# Altium project WUT-4-3-3.PrjPCB (part 1 of 2)
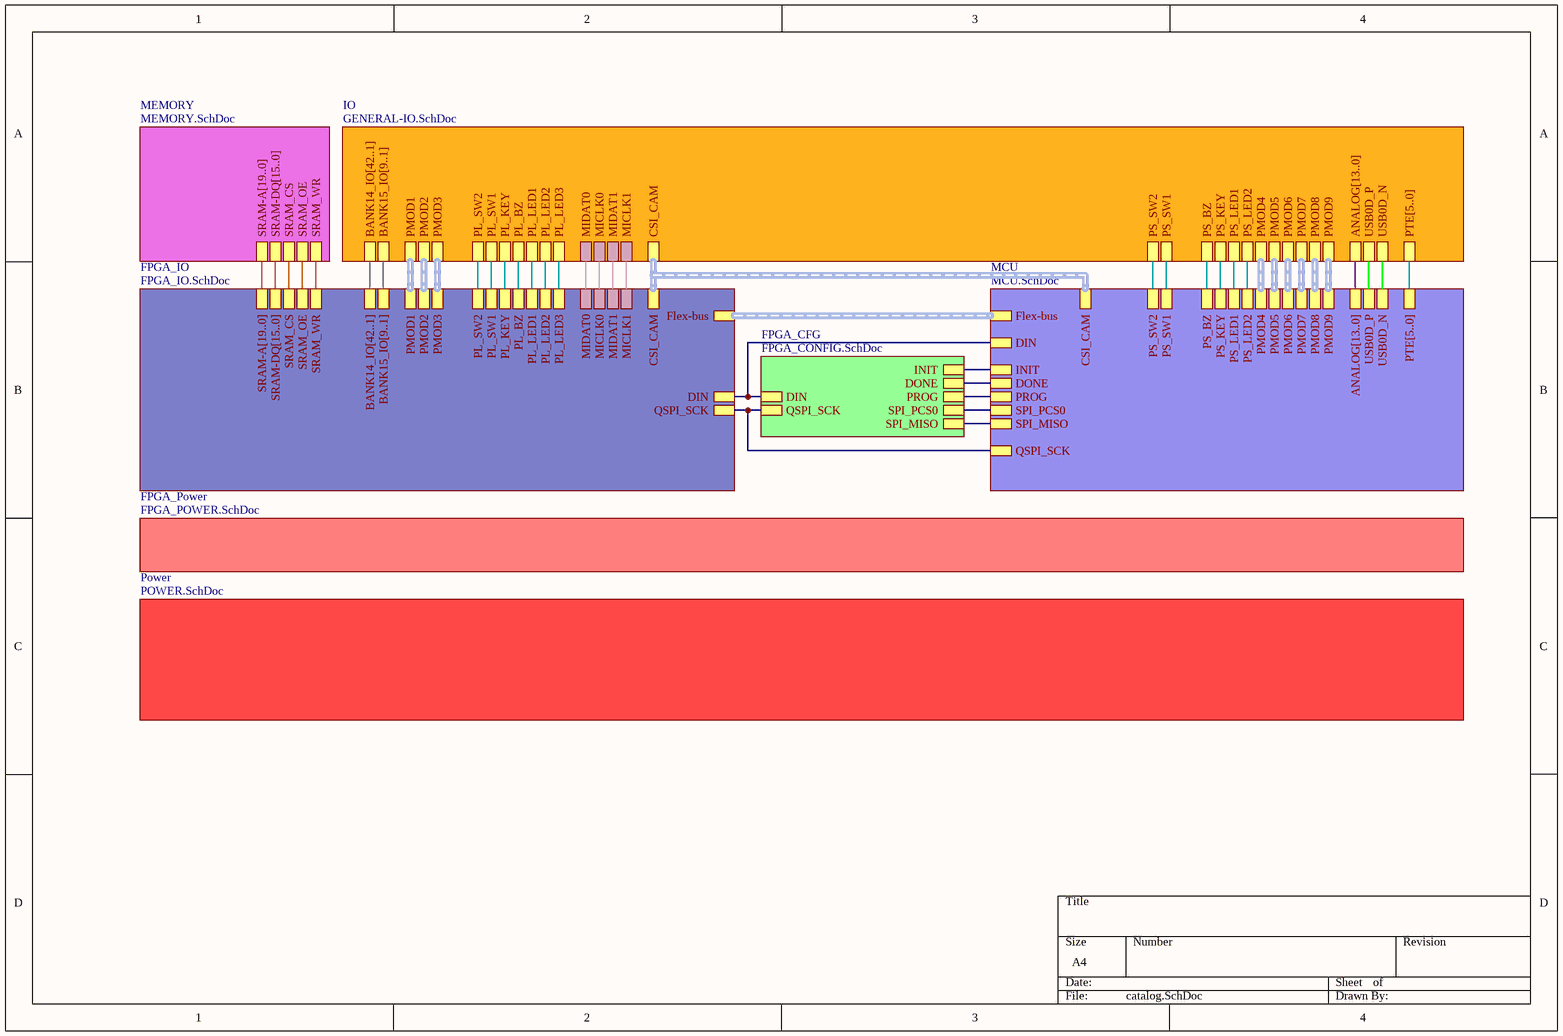
[diagram p0: catalog.SchDoc]
8 sheets, 241 parts. Net scope: hierarchical (ports join the sheet entries above them; power ports are global).
Board file: WUT-4-3-5.PcbDoc
Sheets:
  catalog.SchDoc
    FPGA_IO = FPGA_IO.SchDoc
    Power = POWER.SchDoc
    IO = GENERAL-IO.SchDoc
    MEMORY = MEMORY.SchDoc
    FPGA_CFG = FPGA_CONFIG.SchDoc
    FPGA_Power = FPGA_POWER.SchDoc
    MCU = MCU.SchDoc

## Sheet catalog.SchDoc
size A4

### Sub-sheets
FPGA_CFG = FPGA_CONFIG.SchDoc: QSPI_SCK, DIN, INIT, DONE, PROG, SPI_PCS0, SPI_MISO
FPGA_IO = FPGA_IO.SchDoc: QSPI_SCK, BANK14_IO[42..1], BANK15_IO[9..1], DIN, Flex-bus (harness Flexbus), SRAM-A[19..0] (harness Flexbus), SRAM-DQ[15..0] (harness Flexbus), SRAM_CS, SRAM_OE, SRAM_WR, PL_SW2, PL_SW1, PL_KEY, PL_LED1, PL_LED2, PL_LED3, PMOD1 (harness PMOD), PMOD2 (harness PMOD), PMOD3 (harness PMOD), PL_BZ, CSI_CAM (harness CSI_CAM), MIDAT0, MIDAT1, MICLK0, MICLK1
FPGA_Power = FPGA_POWER.SchDoc: no entries
IO = GENERAL-IO.SchDoc: BANK14_IO[42..1], BANK15_IO[9..1], PTE[5..0] (harness Flexbus), USB0D_P, USB0D_N, ANALOG[13..0], PMOD4 (harness PMOD), PS_LED2, PS_LED1, PL_SW2, PL_SW1, PL_KEY, PS_KEY, PS_SW1, PS_SW2, PL_LED1, PL_LED2, PL_LED3, PMOD1 (harness PMOD), PMOD2 (harness PMOD), PMOD3 (harness PMOD), PL_BZ, PS_BZ, PMOD7 (harness PMOD), PMOD6 (harness PMOD), PMOD5 (harness PMOD), PMOD8 (harness PMOD), PMOD9 (harness PMOD), CSI_CAM (harness CSI_CAM), MIDAT0, MIDAT1, MICLK0, MICLK1
MCU = MCU.SchDoc: Flex-bus (harness Flexbus), PTE[5..0] (harness Flexbus), USB0D_N, USB0D_P, ANALOG[13..0], PMOD7 (harness PMOD), PMOD4 (harness PMOD), PMOD6 (harness PMOD), PMOD5 (harness PMOD), DIN, INIT, DONE, PROG, SPI_PCS0, SPI_MISO, QSPI_SCK, PS_LED2, PS_LED1, PS_KEY, PS_SW1, PS_SW2, PS_BZ, PMOD8 (harness PMOD), PMOD9 (harness PMOD), CSI_CAM (harness CSI_CAM)
MEMORY = MEMORY.SchDoc: SRAM-A[19..0] (harness Flexbus), SRAM-DQ[15..0] (harness Flexbus), SRAM_CS, SRAM_OE, SRAM_WR
Power = POWER.SchDoc: no entries

### Nets
BANK14_IO1: sheet FPGA_IO/PL_KEY, sheet IO/PL_KEY
BANK14_IO2: sheet FPGA_IO/PL_LED3, sheet IO/PL_LED3
BANK14_IO4: sheet FPGA_IO/PL_LED1, sheet IO/PL_LED1
BANK14_IO5: sheet FPGA_IO/PL_LED2, sheet IO/PL_LED2
BANK14_IO6: sheet FPGA_IO/PL_BZ, sheet IO/PL_BZ
BANK34_IO1: sheet FPGA_IO/MICLK0, sheet IO/MICLK0
BANK34_IO2: sheet FPGA_IO/MIDAT0, sheet IO/MIDAT0
BANK34_IO13: sheet FPGA_IO/PL_SW1, sheet IO/PL_SW1
BANK34_IO20: sheet FPGA_IO/PL_SW2, sheet IO/PL_SW2
BANK35_IO9: sheet FPGA_IO/MIDAT1, sheet IO/MIDAT1
BANK35_IO10: sheet FPGA_IO/MICLK1, sheet IO/MICLK1
DIN: sheet FPGA_IO/DIN, sheet FPGA_CFG/DIN, sheet MCU/DIN
DONE: sheet FPGA_CFG/DONE, sheet MCU/DONE
FPGA_INIT: sheet FPGA_CFG/INIT, sheet MCU/INIT
PROG: sheet FPGA_CFG/PROG, sheet MCU/PROG
PTA6: sheet IO/PS_SW1, sheet MCU/PS_SW1
PTA7: sheet IO/PS_SW2, sheet MCU/PS_SW2
PTD8: sheet IO/PS_LED1, sheet MCU/PS_LED1
PTD9: sheet IO/PS_LED2, sheet MCU/PS_LED2
PTE26: sheet IO/PS_BZ, sheet MCU/PS_BZ
PTE27: sheet IO/PS_KEY, sheet MCU/PS_KEY
QSPI_SCK: sheet FPGA_IO/QSPI_SCK, sheet FPGA_CFG/QSPI_SCK, sheet MCU/QSPI_SCK
SPI2_PCS0: sheet FPGA_CFG/SPI_PCS0, sheet MCU/SPI_PCS0
SPI2_SIN: sheet FPGA_CFG/SPI_MISO, sheet MCU/SPI_MISO
SRAM_CS: sheet FPGA_IO/SRAM_CS, sheet MEMORY/SRAM_CS
SRAM_OE: sheet FPGA_IO/SRAM_OE, sheet MEMORY/SRAM_OE
SRAM_WR: sheet FPGA_IO/SRAM_WR, sheet MEMORY/SRAM_WR
USB0D_N: sheet IO/USB0D_N, sheet MCU/USB0D_N
USB0D_P: sheet IO/USB0D_P, sheet MCU/USB0D_P

### Buses and harness runs
bus sheet FPGA_IO/BANK14_IO[42..1] = sheet IO/BANK14_IO[42..1]
bus sheet FPGA_IO/BANK15_IO[9..1] = sheet IO/BANK15_IO[9..1]
bus sheet IO/ANALOG[13..0] = sheet MCU/ANALOG[13..0]
harness sheet FPGA_IO/CSI_CAM = sheet IO/CSI_CAM = sheet MCU/CSI_CAM
harness sheet FPGA_IO/Flex-bus = sheet MCU/Flex-bus
harness sheet FPGA_IO/PMOD1 = sheet IO/PMOD1
harness sheet FPGA_IO/PMOD2 = sheet IO/PMOD2
harness sheet FPGA_IO/PMOD3 = sheet IO/PMOD3
harness sheet IO/PMOD4 = sheet MCU/PMOD4
harness sheet IO/PMOD5 = sheet MCU/PMOD5
harness sheet IO/PMOD6 = sheet MCU/PMOD6
harness sheet IO/PMOD7 = sheet MCU/PMOD7
harness sheet IO/PMOD8 = sheet MCU/PMOD8
harness sheet IO/PMOD9 = sheet MCU/PMOD9

## Sheet FPGA_IO.SchDoc
size A3
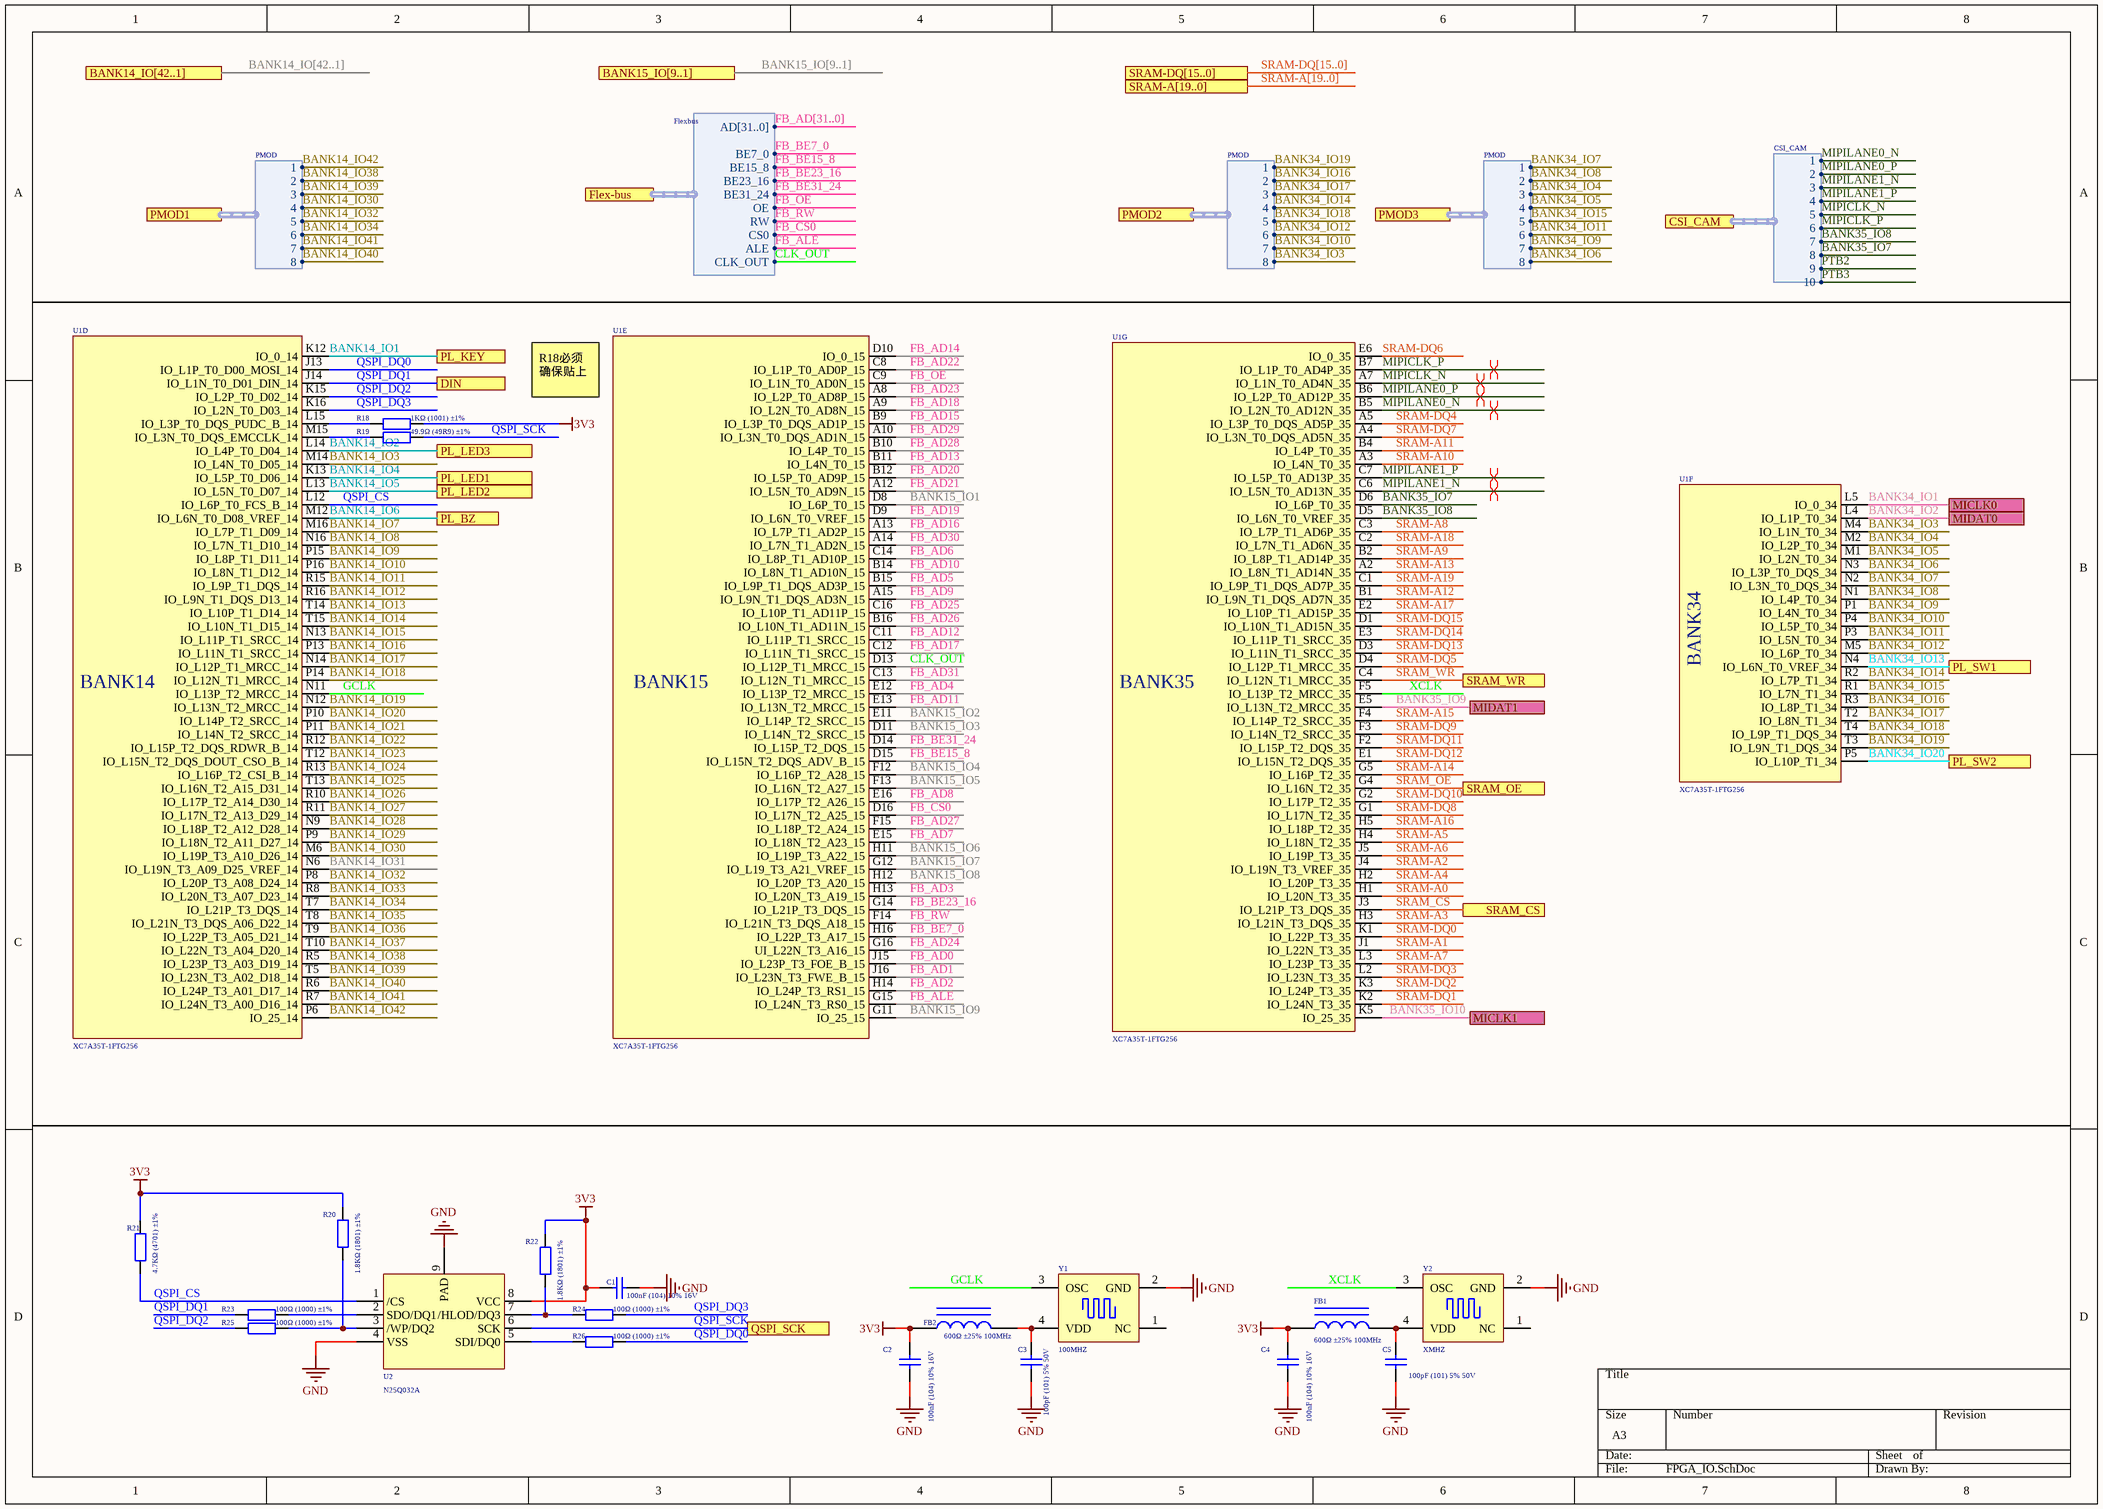
[diagram p1: FPGA_IO.SchDoc]

### Parts
C1  100nF (104) 10% 16V  [0402_C]
C2  100nF (104) 10% 16V  [0402_C]
C3  100pF (101) 5% 50V  [0402_C]
C4  100nF (104) 10% 16V  [0402_C]
C5  100pF (101) 5% 50V  [0402_C]
FB1  600Ω ±25% 100MHz  [0805_L]
FB2  600Ω ±25% 100MHz  [0805_L]
R18  1KΩ (1001) ±1%  [0402_R]
R19  49.9Ω (49R9) ±1%  [0402_R]
R20  1.8KΩ (1801) ±1%  [0603_R]
R21  4.7KΩ (4701) ±1%  [0402_R]
R22  1.8KΩ (1801) ±1%  [0603_R]
R23  100Ω (1000) ±1%  [0402_R]
R24  100Ω (1000) ±1%  [0402_R]
R25  100Ω (1000) ±1%  [0402_R]
R26  100Ω (1000) ±1%  [0402_R]
U1  XC7A35T-1FTG256  [BGA100P9X9-81A]  (parts D,E,F,G of 7)
U2  N25Q032A  [QFN127P500X600X100_HS-9N]
Y1  100MHZ  [XTAL7_3225]
Y2  XMHZ  [XTAL7_3225]

### Ports
BANK14_IO[42..1], BANK15_IO[9..1], CSI_CAM (harness CSI_CAM), DIN, Flex-bus (harness Flexbus), MICLK0, MICLK1, MIDAT0, MIDAT1, PL_BZ, PL_KEY, PL_LED1, PL_LED2, PL_LED3, PL_SW1, PL_SW2, PMOD1 (harness PMOD), PMOD2 (harness PMOD), PMOD3 (harness PMOD), QSPI_SCK, SRAM-A[19..0], SRAM-DQ[15..0], SRAM_CS, SRAM_OE, SRAM_WR

### Harnesses
Flexbus: BE7_0, CS0, BE31_24, CLK_OUT, ALE, BE23_16, RW, BE15_8, OE, AD[31..0]
PMOD: 1, 2, 3, 4, 5, 6, 7, 8
CSI_CAM: 1, 2, 3, 4, 5, 6, 7, 8, 9, 10

### Nets
3V3: C1.1 C2.2 C4.2 FB1.1 FB2.1 R18.2 R20.2 R21.2 R22.2 U2.8(VCC)
GND: C1.2 C2.1 C3.1 C4.1 C5.1 U2.4(VSS) U2.9(PAD) Y1.2(GND) Y2.2(GND)
BANK14_IO1: U1.K12(IO_0_14) ; port PL_KEY
BANK14_IO2: U1.L14(IO_L4P_T0_D04_14) ; port PL_LED3
BANK14_IO3: U1.M14(IO_L4N_T0_D05_14)
BANK14_IO4: U1.K13(IO_L5P_T0_D06_14) ; port PL_LED1
BANK14_IO5: U1.L13(IO_L5N_T0_D07_14) ; port PL_LED2
BANK14_IO6: U1.M12(IO_L6N_T0_D08_VREF_14) ; port PL_BZ
BANK14_IO7: U1.M16(IO_L7P_T1_D09_14)
BANK14_IO8: U1.N16(IO_L7N_T1_D10_14)
BANK14_IO9: U1.P15(IO_L8P_T1_D11_14)
BANK14_IO10: U1.P16(IO_L8N_T1_D12_14)
BANK14_IO11: U1.R15(IO_L9P_T1_DQS_14)
BANK14_IO12: U1.R16(IO_L9N_T1_DQS_D13_14)
BANK14_IO13: U1.T14(IO_L10P_T1_D14_14)
BANK14_IO14: U1.T15(IO_L10N_T1_D15_14)
BANK14_IO15: U1.N13(IO_L11P_T1_SRCC_14)
BANK14_IO16: U1.P13(IO_L11N_T1_SRCC_14)
BANK14_IO17: U1.N14(IO_L12P_T1_MRCC_14)
BANK14_IO18: U1.P14(IO_L12N_T1_MRCC_14)
BANK14_IO19: U1.N12(IO_L13N_T2_MRCC_14)
BANK14_IO20: U1.P10(IO_L14P_T2_SRCC_14)
BANK14_IO21: U1.P11(IO_L14N_T2_SRCC_14)
BANK14_IO22: U1.R12(IO_L15P_T2_DQS_RDWR_B_14)
BANK14_IO23: U1.T12(IO_L15N_T2_DQS_DOUT_CSO_B_14)
BANK14_IO24: U1.R13(IO_L16P_T2_CSI_B_14)
BANK14_IO25: U1.T13(IO_L16N_T2_A15_D31_14)
BANK14_IO26: U1.R10(IO_L17P_T2_A14_D30_14)
BANK14_IO27: U1.R11(IO_L17N_T2_A13_D29_14)
BANK14_IO28: U1.N9(IO_L18P_T2_A12_D28_14)
BANK14_IO29: U1.P9(IO_L18N_T2_A11_D27_14)
BANK14_IO30: U1.M6(IO_L19P_T3_A10_D26_14) ; port PMOD1.4
BANK14_IO31: U1.N6(IO_L19N_T3_A09_D25_VREF_14)
BANK14_IO32: U1.P8(IO_L20P_T3_A08_D24_14) ; port PMOD1.5
BANK14_IO33: U1.R8(IO_L20N_T3_A07_D23_14)
BANK14_IO34: U1.T7(IO_L21P_T3_DQS_14) ; port PMOD1.6
BANK14_IO35: U1.T8(IO_L21N_T3_DQS_A06_D22_14)
BANK14_IO36: U1.T9(IO_L22P_T3_A05_D21_14)
BANK14_IO37: U1.T10(IO_L22N_T3_A04_D20_14)
BANK14_IO38: U1.R5(IO_L23P_T3_A03_D19_14) ; port PMOD1.2
BANK14_IO39: U1.T5(IO_L23N_T3_A02_D18_14) ; port PMOD1.3
BANK14_IO40: U1.R6(IO_L24P_T3_A01_D17_14) ; port PMOD1.8
BANK14_IO41: U1.R7(IO_L24N_T3_A00_D16_14) ; port PMOD1.7
BANK14_IO42: U1.P6(IO_25_14) ; port PMOD1.1
BANK15_IO1: U1.D8(IO_L6P_T0_15)
BANK15_IO2: U1.E11(IO_L14P_T2_SRCC_15)
BANK15_IO3: U1.D11(IO_L14N_T2_SRCC_15)
BANK15_IO4: U1.F12(IO_L16P_T2_A28_15)
BANK15_IO5: U1.F13(IO_L16N_T2_A27_15)
BANK15_IO6: U1.H11(IO_L19P_T3_A22_15)
BANK15_IO7: U1.G12(IO_L19_T3_A21_VREF_15)
BANK15_IO8: U1.H12(IO_L20P_T3_A20_15)
BANK15_IO9: U1.G11(IO_25_15)
BANK34_IO1: U1.L5(IO_0_34) ; port MICLK0
BANK34_IO2: U1.L4(IO_L1P_T0_34) ; port MIDAT0
BANK34_IO3: U1.M4(IO_L1N_T0_34) ; port PMOD2.8
BANK34_IO4: U1.M2(IO_L2P_T0_34) ; port PMOD3.3
BANK34_IO5: U1.M1(IO_L2N_T0_34) ; port PMOD3.4
BANK34_IO6: U1.N3(IO_L3P_T0_DQS_34) ; port PMOD3.8
BANK34_IO7: U1.N2(IO_L3N_T0_DQS_34) ; port PMOD3.1
BANK34_IO8: U1.N1(IO_L4P_T0_34) ; port PMOD3.2
BANK34_IO9: U1.P1(IO_L4N_T0_34) ; port PMOD3.7
BANK34_IO10: U1.P4(IO_L5P_T0_34) ; port PMOD2.7
BANK34_IO11: U1.P3(IO_L5N_T0_34) ; port PMOD3.6
BANK34_IO12: U1.M5(IO_L6P_T0_34) ; port PMOD2.6
BANK34_IO13: U1.N4(IO_L6N_T0_VREF_34) ; port PL_SW1
BANK34_IO14: U1.R2(IO_L7P_T1_34) ; port PMOD2.4
BANK34_IO15: U1.R1(IO_L7N_T1_34) ; port PMOD3.5
BANK34_IO16: U1.R3(IO_L8P_T1_34) ; port PMOD2.2
BANK34_IO17: U1.T2(IO_L8N_T1_34) ; port PMOD2.3
BANK34_IO18: U1.T4(IO_L9P_T1_DQS_34) ; port PMOD2.5
BANK34_IO19: U1.T3(IO_L9N_T1_DQS_34) ; port PMOD2.1
BANK34_IO20: U1.P5(IO_L10P_T1_34) ; port PL_SW2
BANK35_IO7: U1.D6(IO_L6P_T0_35) ; port CSI_CAM.8
BANK35_IO8: U1.D5(IO_L6N_T0_VREF_35) ; port CSI_CAM.7
BANK35_IO9: U1.E5(IO_L13N_T2_MRCC_35) ; port MIDAT1
BANK35_IO10: U1.K5(IO_25_35) ; port MICLK1
CLK_OUT: U1.D13(IO_L12P_T1_MRCC_15) ; port Flex-bus.CLK_OUT
FB_AD0: U1.J15(IO_L23P_T3_FOE_B_15)
FB_AD1: U1.J16(IO_L23N_T3_FWE_B_15)
FB_AD2: U1.H14(IO_L24P_T3_RS1_15)
FB_AD3: U1.H13(IO_L20N_T3_A19_15)
FB_AD4: U1.E12(IO_L13P_T2_MRCC_15)
FB_AD5: U1.B15(IO_L9P_T1_DQS_AD3P_15)
FB_AD6: U1.C14(IO_L8P_T1_AD10P_15)
FB_AD7: U1.E15(IO_L18N_T2_A23_15)
FB_AD8: U1.E16(IO_L17P_T2_A26_15)
FB_AD9: U1.A15(IO_L9N_T1_DQS_AD3N_15)
FB_AD10: U1.B14(IO_L8N_T1_AD10N_15)
FB_AD11: U1.E13(IO_L13N_T2_MRCC_15)
FB_AD12: U1.C11(IO_L11P_T1_SRCC_15)
FB_AD13: U1.B11(IO_L4N_T0_15)
FB_AD14: U1.D10(IO_0_15)
FB_AD15: U1.B9(IO_L3P_T0_DQS_AD1P_15)
FB_AD16: U1.A13(IO_L7P_T1_AD2P_15)
FB_AD17: U1.C12(IO_L11N_T1_SRCC_15)
FB_AD18: U1.A9(IO_L2N_T0_AD8N_15)
FB_AD19: U1.D9(IO_L6N_T0_VREF_15)
FB_AD20: U1.B12(IO_L5P_T0_AD9P_15)
FB_AD21: U1.A12(IO_L5N_T0_AD9N_15)
FB_AD22: U1.C8(IO_L1P_T0_AD0P_15)
FB_AD23: U1.A8(IO_L2P_T0_AD8P_15)
FB_AD24: U1.G16(UI_L22N_T3_A16_15)
FB_AD25: U1.C16(IO_L10P_T1_AD11P_15)
FB_AD26: U1.B16(IO_L10N_T1_AD11N_15)
FB_AD27: U1.F15(IO_L18P_T2_A24_15)
FB_AD28: U1.B10(IO_L4P_T0_15)
FB_AD29: U1.A10(IO_L3N_T0_DQS_AD1N_15)
FB_AD30: U1.A14(IO_L7N_T1_AD2N_15)
FB_AD31: U1.C13(IO_L12N_T1_MRCC_15)
FB_ALE: U1.G15(IO_L24N_T3_RS0_15) ; port Flex-bus.ALE
FB_BE7_0: U1.H16(IO_L22P_T3_A17_15) ; port Flex-bus.BE7_0
FB_BE15_8: U1.D15(IO_L15N_T2_DQS_ADV_B_15) ; port Flex-bus.BE15_8
FB_BE23_16: U1.G14(IO_L21P_T3_DQS_15) ; port Flex-bus.BE23_16
FB_BE31_24: U1.D14(IO_L15P_T2_DQS_15) ; port Flex-bus.BE31_24
FB_CS0: U1.D16(IO_L17N_T2_A25_15) ; port Flex-bus.CS0
FB_OE: U1.C9(IO_L1N_T0_AD0N_15) ; port Flex-bus.OE
FB_RW: U1.F14(IO_L21N_T3_DQS_A18_15) ; port Flex-bus.RW
GCLK: U1.N11(IO_L13P_T2_MRCC_14) Y1.3(OSC)
MIPICLK_N: U1.A7(IO_L1N_T0_AD4N_35) ; port CSI_CAM.5
MIPICLK_P: U1.B7(IO_L1P_T0_AD4P_35) ; port CSI_CAM.6
MIPILANE0_N: U1.B5(IO_L2N_T0_AD12N_35) ; port CSI_CAM.1
MIPILANE0_P: U1.B6(IO_L2P_T0_AD12P_35) ; port CSI_CAM.2
MIPILANE1_N: U1.C6(IO_L5N_T0_AD13N_35) ; port CSI_CAM.3
MIPILANE1_P: U1.C7(IO_L5P_T0_AD13P_35) ; port CSI_CAM.4
QSPI_CS: R21.1 U1.L12(IO_L6P_T0_FCS_B_14) U2.1(/CS)
QSPI_DQ0: R26.2 U1.J13(IO_L1P_T0_D00_MOSI_14)
QSPI_DQ1: R23.1 U1.J14(IO_L1N_T0_D01_DIN_14) ; port DIN  [project net DIN]
QSPI_DQ2: R25.1 U1.K15(IO_L2P_T0_D02_14)
QSPI_DQ3: R24.2 U1.K16(IO_L2N_T0_D03_14)
QSPI_SCK: R19.2 U2.6(SCK) ; port QSPI_SCK
SRAM-A0: U1.H1(IO_L20N_T3_35)
SRAM-A1: U1.J1(IO_L22N_T3_35)
SRAM-A2: U1.J4(IO_L19N_T3_VREF_35)
SRAM-A3: U1.H3(IO_L21N_T3_DQS_35)
SRAM-A4: U1.H2(IO_L20P_T3_35)
SRAM-A5: U1.H4(IO_L18N_T2_35)
SRAM-A6: U1.J5(IO_L19P_T3_35)
SRAM-A7: U1.L3(IO_L23P_T3_35)
SRAM-A8: U1.C3(IO_L7P_T1_AD6P_35)
SRAM-A9: U1.B2(IO_L8P_T1_AD14P_35)
SRAM-A10: U1.A3(IO_L4N_T0_35)
SRAM-A11: U1.B4(IO_L4P_T0_35)
SRAM-A12: U1.B1(IO_L9N_T1_DQS_AD7N_35)
SRAM-A13: U1.A2(IO_L8N_T1_AD14N_35)
SRAM-A14: U1.G5(IO_L16P_T2_35)
SRAM-A15: U1.F4(IO_L14P_T2_SRCC_35)
SRAM-A16: U1.H5(IO_L18P_T2_35)
SRAM-A17: U1.E2(IO_L10P_T1_AD15P_35)
SRAM-A18: U1.C2(IO_L7N_T1_AD6N_35)
SRAM-A19: U1.C1(IO_L9P_T1_DQS_AD7P_35)
SRAM-DQ0: U1.K1(IO_L22P_T3_35)
SRAM-DQ1: U1.K2(IO_L24N_T3_35)
SRAM-DQ2: U1.K3(IO_L24P_T3_35)
SRAM-DQ3: U1.L2(IO_L23N_T3_35)
SRAM-DQ4: U1.A5(IO_L3P_T0_DQS_AD5P_35)
SRAM-DQ5: U1.D4(IO_L12P_T1_MRCC_35)
SRAM-DQ6: U1.E6(IO_0_35)
SRAM-DQ7: U1.A4(IO_L3N_T0_DQS_AD5N_35)
SRAM-DQ8: U1.G1(IO_L17N_T2_35)
SRAM-DQ9: U1.F3(IO_L14N_T2_SRCC_35)
SRAM-DQ10: U1.G2(IO_L17P_T2_35)
SRAM-DQ11: U1.F2(IO_L15P_T2_DQS_35)
SRAM-DQ12: U1.E1(IO_L15N_T2_DQS_35)
SRAM-DQ13: U1.D3(IO_L11N_T1_SRCC_35)
SRAM-DQ14: U1.E3(IO_L11P_T1_SRCC_35)
SRAM-DQ15: U1.D1(IO_L10N_T1_AD15N_35)
SRAM_CS: U1.J3(IO_L21P_T3_DQS_35) ; port SRAM_CS
SRAM_OE: U1.G4(IO_L16N_T2_35) ; port SRAM_OE
SRAM_WR: U1.C4(IO_L12N_T1_MRCC_35) ; port SRAM_WR
XCLK: U1.F5(IO_L13P_T2_MRCC_35) Y2.3(OSC)
NetC3_2: C3.2 FB2.2 Y1.4(VDD)
NetC5_2: C5.2 FB1.2 Y2.4(VDD)
NetR18_1: R18.1 U1.L15(IO_L3P_T0_DQS_PUDC_B_14)
NetR19_1: R19.1 U1.M15(IO_L3N_T0_DQS_EMCCLK_14)
NetR20_1: R20.1 R25.2 U2.3(/WP/DQ2)
NetR22_1: R22.1 R24.1 U2.7(/HLOD/DQ3)
NetR23_2: R23.2 U2.2(SDO/DQ1)
NetR26_1: R26.1 U2.5(SDI/DQ0)

Not connected (* = marked no-connect by the designer): Y1 1(NC); Y2 1(NC)

### Buses and harness runs
bus BANK14_IO[42..1] = port BANK14_IO[42..1]
bus BANK15_IO[9..1] = port BANK15_IO[9..1]
bus FB_AD[31..0]
bus SRAM-A[19..0] = port SRAM-A[19..0]
bus SRAM-DQ[15..0] = port SRAM-DQ[15..0]

### Layout directives
differential pair: MIPICLK_N, MIPICLK_P, MIPILANE0_N, MIPILANE0_P, MIPILANE1_N, MIPILANE1_P

### Notes on the sheet
- R18必须确保贴上
- (in symbol XC7A35T-1FTG256, part D) BANK14
- (in symbol XC7A35T-1FTG256, part E) BANK15
- (in symbol XC7A35T-1FTG256, part F) BANK34
- (in symbol XC7A35T-1FTG256, part G) BANK35

### Library data of the parts
C1 C2 C4 = 0402 100nF (104) 10% 16V: 贴片电容; ComponentLink1Description: 供应商链接; ComponentLink1URL: http://www.szlcsc.com/product/details_1877.html; Package: 0402; Supplier: LC; SuppliersPartNumber: C1525
C3 C5 = 0402 100pF (101) 5% 50V: 贴片电容; ComponentLink1Description: 供应商链接; ComponentLink1URL: http://www.szlcsc.com/product/details_1898.html; Package: 0402; Supplier: LC; SuppliersPartNumber: C1546
FB1 FB2 = 0805 600Ω 25% 100MHz: 贴片磁珠; ComponentLink1Description: 供应商链接; ComponentLink1URL: http://www.szlcsc.com/product/details_1369.html; Package: 0805; Supplier: LC; SuppliersPartNumber: C1017
R18 = 0402 1KΩ (1001) 1%: 贴片电阻; ComponentLink1Description: 供应商链接; ComponentLink1URL: http://www.szlcsc.com/product/details_12256.html; Package: 0402; Supplier: LC; SuppliersPartNumber: C11702
R19 = 0402 49.9Ω (49R9) 1%: 贴片电阻; ComponentLink1Description: 供应商链接; ComponentLink1URL: http://www.szlcsc.com/product/details_25863.html; Package: 0402; Supplier: LC; SuppliersPartNumber: C25120
R20 R22 = 0603 1.8KΩ (1801) 1%: 贴片电阻; ComponentLink1Description: 供应商链接; ComponentLink1URL: http://www.szlcsc.com/product/details_4584.html; Package: 0603; Supplier: LC; SuppliersPartNumber: C4177
R21 = 0402 4.7KΩ (4701) 1%: 贴片电阻; ComponentLink1Description: 供应商链接; ComponentLink1URL: http://www.szlcsc.com/product/details_26643.html; Package: 0402; Supplier: LC; SuppliersPartNumber: C25900
R23-R26 = 0402 100Ω (1000) 1%: 贴片电阻; ComponentLink1Description: 供应商链接; ComponentLink1URL: http://www.szlcsc.com/product/details_25819.html; Package: 0402; Supplier: LC; SuppliersPartNumber: C25076
Y1 Y2 = XTAL1

## Sheet POWER.SchDoc
size A3
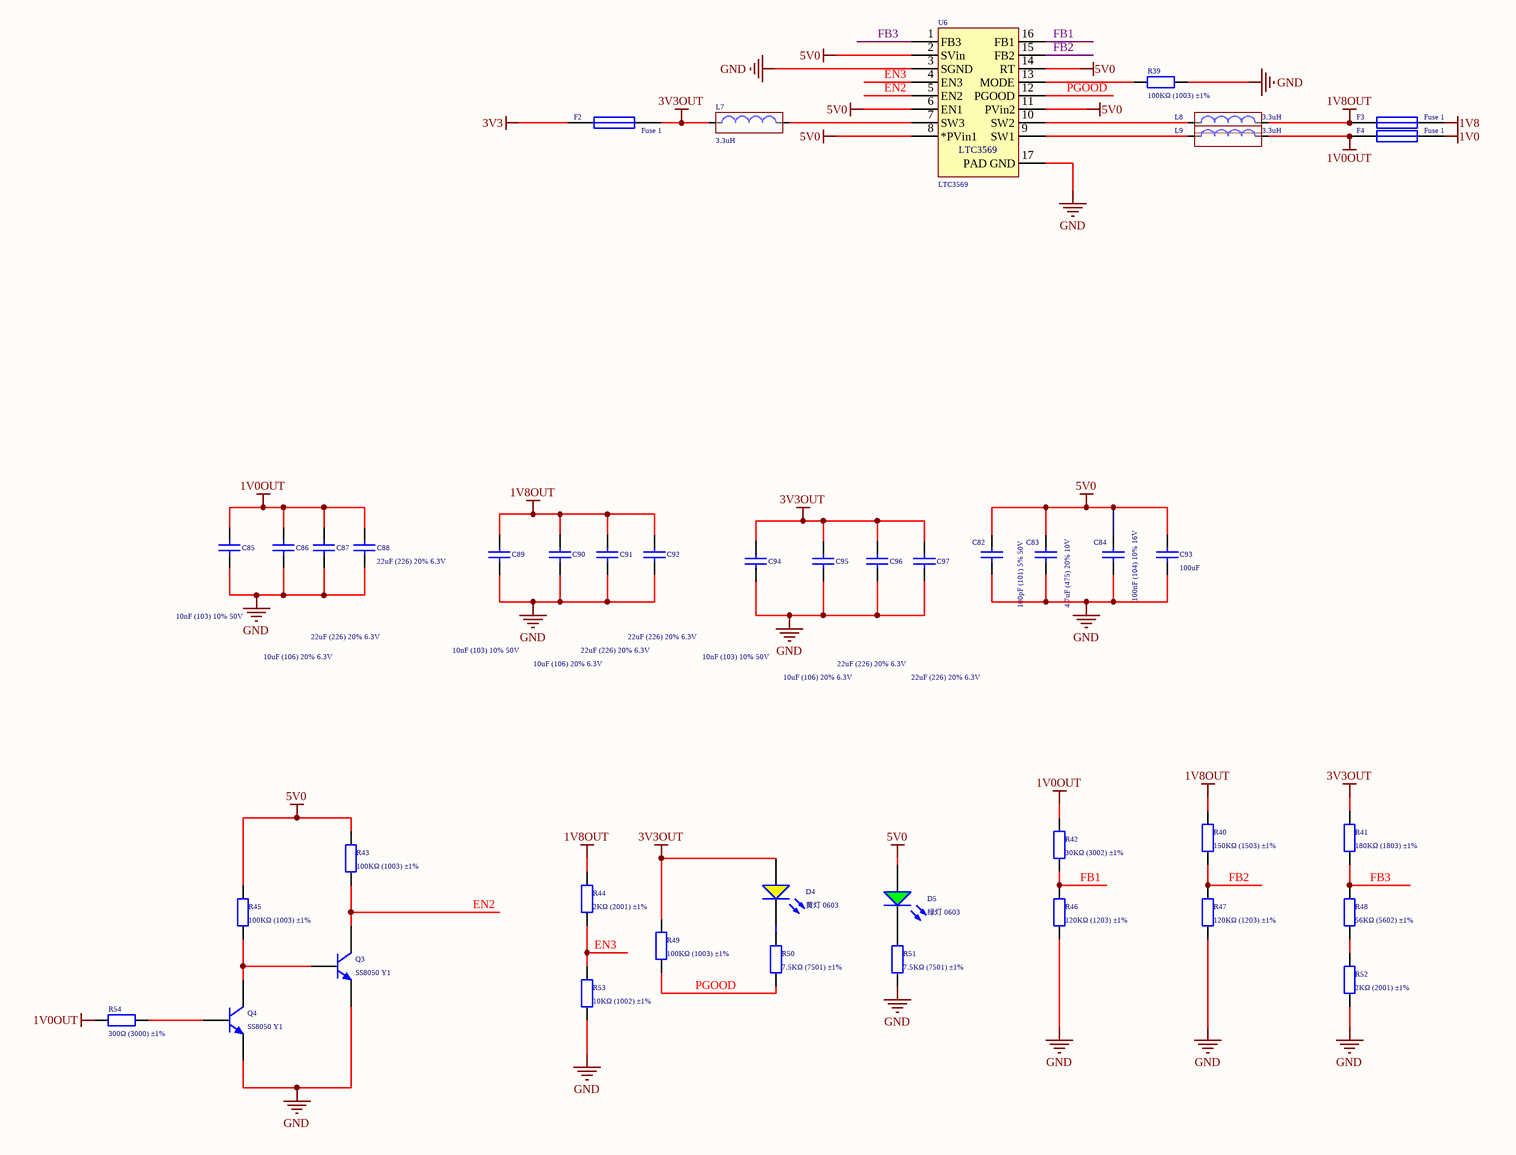
[diagram p2: POWER.SchDoc]

### Parts
C82  100pF (101) 5% 50V  [0402_C]
C83  4.7uF (475) 20% 10V  [0402_C]
C84  100nF (104) 10% 16V  [0402_C]
C85  10nF (103) 10% 50V  [0402_C]
C86  10uF (106) 20% 6.3V  [0402_C]
C87  22uF (226) 20% 6.3V  [0603_C]
C88  22uF (226) 20% 6.3V  [0603_C]
C89  10nF (103) 10% 50V  [0402_C]
C90  10uF (106) 20% 6.3V  [0402_C]
C91  22uF (226) 20% 6.3V  [0603_C]
C92  22uF (226) 20% 6.3V  [0603_C]
C93  value 100uF  [LC-1206]  (hidden comment: Cap)
C94  10nF (103) 10% 50V  [0402_C]
C95  10uF (106) 20% 6.3V  [0402_C]
C96  22uF (226) 20% 6.3V  [0603_C]
C97  22uF (226) 20% 6.3V  [0603_C]
D4  黄灯 0603  [0603_LED_S1]
D5  绿灯 0603  [0603_LED_S1]
F2  Fuse 1  [1206]
F3  Fuse 1  [1206]
F4  Fuse 1  [1206]
L7  3.3uH  [LC-1210]
L8  3.3uH  [LC-1210]
L9  3.3uH  [LC-1210]
Q3  SS8050 Y1  [SOT-23(SOT-23-3)]
Q4  SS8050 Y1  [SOT-23(SOT-23-3)]
R39  100KΩ (1003) ±1%  [0402_R]
R40  150KΩ (1503) ±1%  [0402_R]
R41  180KΩ (1803) ±1%  [0603_R]
R42  30KΩ (3002) ±1%  [0603_R]
R43  100KΩ (1003) ±1%  [0402_R]
R44  2KΩ (2001) ±1%  [0402_R]
R45  100KΩ (1003) ±1%  [0402_R]
R46  120KΩ (1203) ±1%  [0402_R]
R47  120KΩ (1203) ±1%  [0402_R]
R48  56KΩ (5602) ±1%  [0402_R]
R49  100KΩ (1003) ±1%  [0402_R]
R50  7.5KΩ (7501) ±1%  [0402_R]
R51  7.5KΩ (7501) ±1%  [0402_R]
R52  2KΩ (2001) ±1%  [0402_R]
R53  10KΩ (1002) ±1%  [0402_R]
R54  300Ω (3000) ±1%  [0402_R]
U6  LTC3569  [SOP127P600-16N]

### Nets
1V0: F4.1
1V0OUT: C85.2 C86.2 C87.2 C88.2 F4.2 L9.2 R42.2 R54.1
1V8: F3.1
1V8OUT: C89.2 C90.2 C91.2 C92.2 F3.2 L8.2 R40.2 R44.2
3V3: F2.2
3V3OUT: C94.2 C95.2 C96.2 C97.2 D4.A F2.1 L7.1 R41.2 R49.2
5V0: C82.2 C83.1 C84.2 C93.2 D5.A R43.2 R45.2 U6.2(SVin) U6.6(EN1) U6.8(*PVin1) U6.11(PVin2) U6.14(RT)
GND: C82.1 C83.2 C84.1 C85.1 C86.1 C87.1 C88.1 C89.1 C90.1 C91.1 C92.1 C93.1 C94.1 C95.1 C96.1 C97.1 Q3.2(E) Q4.2(E) R39.2 R46.1 R47.1 R51.1 R52.1 R53.1 U6.3(SGND) U6.17(PAD_GND)
EN2: Q3.3(C) R43.1 U6.5(EN2)
EN3: R44.1 R53.2 U6.4(EN3)
FB1: R42.1 R46.2 U6.16(FB1)
FB2: R40.1 R47.2 U6.15(FB2)
FB3: R41.1 R48.2 U6.1(FB3)
PGOOD: R49.1 R50.1 U6.12(PGOOD)
NetD4_K: D4.K R50.2
NetD5_K: D5.K R51.2
NetL7_2: L7.2 U6.7(SW3)
NetL8_1: L8.1 U6.10(SW2)
NetL9_1: L9.1 U6.9(SW1)
NetQ3_1: Q3.1(B) Q4.3(C) R45.1
NetQ4_1: Q4.1(B) R54.2
NetR39_1: R39.1 U6.13(MODE)
NetR48_1: R48.1 R52.2

### Library data of the parts
C82 = 0402 100pF (101) 5% 50V: 贴片电容; ComponentLink1Description: 供应商链接; ComponentLink1URL: http://www.szlcsc.com/product/details_1898.html; Package: 0402; Supplier: LC; SuppliersPartNumber: C1546
C83 = 0402 4.7uF (475) 20% 10V: 贴片电容; ComponentLink1Description: 供应商链接; ComponentLink1URL: http://www.szlcsc.com/product/details_24469.html; Package: 0402; Supplier: LC; SuppliersPartNumber: C23733
C84 = 0402 100nF (104) 10% 16V: 贴片电容; ComponentLink1Description: 供应商链接; ComponentLink1URL: http://www.szlcsc.com/product/details_1877.html; Package: 0402; Supplier: LC; SuppliersPartNumber: C1525
C85 C89 C94 = 0402 10nF (103) 10% 50V: 贴片电容; ComponentLink1Description: 供应商链接; ComponentLink1URL: http://www.szlcsc.com/product/details_15869.html; Package: 0402; Supplier: LC; SuppliersPartNumber: C15195
C86 C90 C95 = 0402 10uF (106) 20% 6.3V: 贴片电容; ComponentLink1Description: 供应商链接; ComponentLink1URL: http://www.szlcsc.com/product/details_16204.html; Package: 0402; Supplier: LC; SuppliersPartNumber: C15525
C87 C88 C91 C92 C96 C97 = 0603 22uF (226) 20% 6.3V: 贴片电容; ComponentLink1Description: 供应商链接; ComponentLink1URL: http://www.szlcsc.com/product/details_60514.html; Package: 0603; Supplier: LC; SuppliersPartNumber: C59461
C93 = Cap: 贴片电容; Published: 8-Jun-2000; LatestRevisionDate: 17-Jul-2002; LatestRevisionNote: Re-released for DXP Platform.; PackageReference: RAD-0.3; Publisher: Altium Limited
D4 = 0603 黄灯: 发光二极管; ComponentLink1Description: 供应商链接; ComponentLink1URL: http://www.szlcsc.com/product/details_73147.html; Package: 0603; Supplier: LC; SuppliersPartNumber: C72038
D5 = 0603 绿灯: 发光二极管; ComponentLink1Description: 供应商链接; ComponentLink1URL: http://www.szlcsc.com/product/details_73152.html; Package: 0603; Supplier: LC; SuppliersPartNumber: C72043
F2-F4 = Fuse 1: Fuse; Published: 8-Jun-2000; LatestRevisionDate: 17-Jul-2002; LatestRevisionNote: Re-released for DXP Platform.; PackageReference: PIN-W2/E2.8; Publisher: Altium Limited; PackageDescription: Thru-Hole; 2 Leads
L7-L9 = Inductor_1: Inductor
Q3 Q4 = SOT-23 SS8050 Y1: 三极管; ComponentLink1Description: 供应商链接; ComponentLink1URL: http://www.szlcsc.com/product/details_2507.html; Package: SOT-23; Supplier: LC; SuppliersPartNumber: C2150
R39 R43 R45 R49 = 0402 100KΩ (1003) 1%: 贴片电阻; ComponentLink1Description: 供应商链接; ComponentLink1URL: http://www.szlcsc.com/product/details_26484.html; Package: 0402; Supplier: LC; SuppliersPartNumber: C25741
R40 = 0402 150KΩ (1503) 1%: 贴片电阻; ComponentLink1Description: 供应商链接; ComponentLink1URL: http://www.szlcsc.com/product/details_26498.html; Package: 0402; Supplier: LC; SuppliersPartNumber: C25755
R41 = 0603 180KΩ (1803) 1%: 贴片电阻; ComponentLink1Description: 供应商链接; ComponentLink1URL: http://www.szlcsc.com/product/details_23554.html; Package: 0603; Supplier: LC; SuppliersPartNumber: C22827
R42 = 0603 30KΩ (3002) 1%: 贴片电阻; ComponentLink1Description: 供应商链接; ComponentLink1URL: http://www.szlcsc.com/product/details_23711.html; Package: 0603; Supplier: LC; SuppliersPartNumber: C22984
R44 R52 = 0402 2KΩ (2001) 1%: 贴片电阻; ComponentLink1Description: 供应商链接; ComponentLink1URL: http://www.szlcsc.com/product/details_4516.html; Package: 0402; Supplier: LC; SuppliersPartNumber: C4109
R46 R47 = 0402 120KΩ (1203) 1%: 贴片电阻; ComponentLink1Description: 供应商链接; ComponentLink1URL: http://www.szlcsc.com/product/details_26493.html; Package: 0402; Supplier: LC; SuppliersPartNumber: C25750
R48 = 0402 56KΩ (5602) 1%: 贴片电阻; ComponentLink1Description: 供应商链接; ComponentLink1URL: http://www.szlcsc.com/product/details_26539.html; Package: 0402; Supplier: LC; SuppliersPartNumber: C25796
R50 R51 = 0402 7.5KΩ (7501) 1%: 贴片电阻; ComponentLink1Description: 供应商链接; ComponentLink1URL: http://www.szlcsc.com/product/details_26661.html; Package: 0402; Supplier: LC; SuppliersPartNumber: C25918
R53 = 0402 10KΩ (1002) 1%: 贴片电阻; ComponentLink1Description: 供应商链接; ComponentLink1URL: http://www.szlcsc.com/product/details_26487.html; Package: 0402; Supplier: LC; SuppliersPartNumber: C25744
R54 = 0402 300Ω (3000) 1%: 贴片电阻; ComponentLink1Description: 供应商链接; ComponentLink1URL: http://www.szlcsc.com/product/details_25845.html; Package: 0402; Supplier: LC; SuppliersPartNumber: C25102

## Sheet GENERAL-IO.SchDoc
size A3
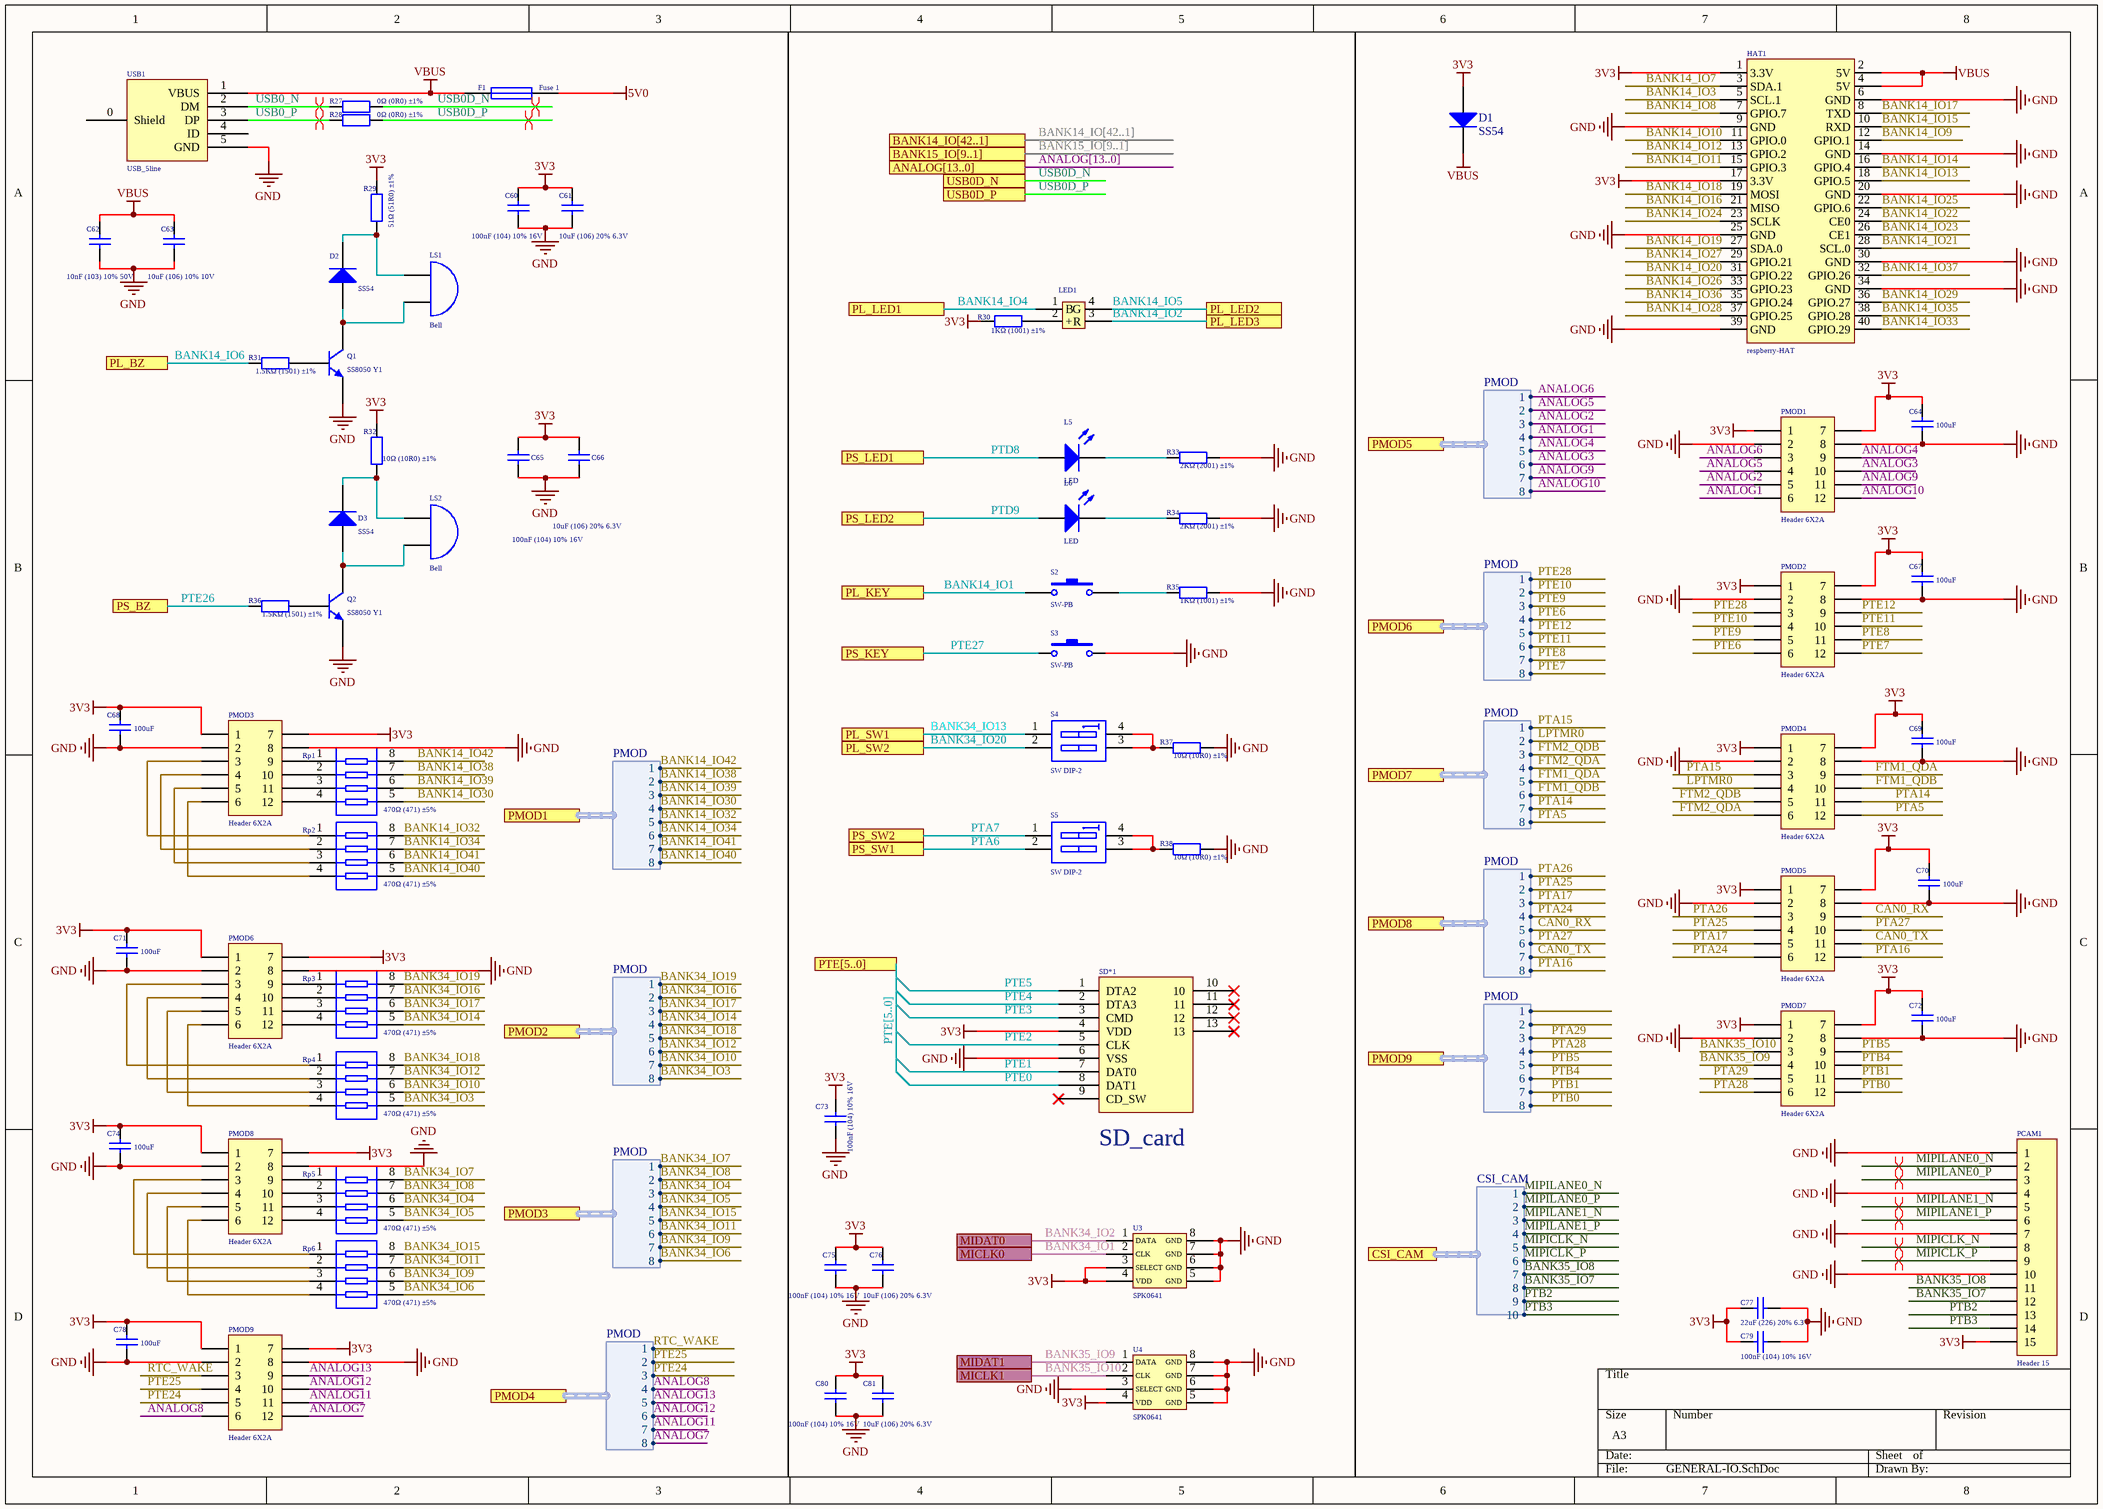
[diagram p3: GENERAL-IO.SchDoc]

### Parts
C60  100nF (104) 10% 16V  [0402_C]
C61  10uF (106) 20% 6.3V  [0402_C]
C62  10nF (103) 10% 50V  [0402_C]
C63  10uF (106) 10% 10V  [0603_C]
C64  value 100uF  [LC-1206]  (hidden comment: Cap)
C65  100nF (104) 10% 16V  [0402_C]
C66  10uF (106) 20% 6.3V  [0402_C]
C67  value 100uF  [LC-1206]  (hidden comment: Cap)
C68  value 100uF  [LC-1206]  (hidden comment: Cap)
C69  value 100uF  [LC-1206]  (hidden comment: Cap)
C70  value 100uF  [LC-1206]  (hidden comment: Cap)
C71  value 100uF  [LC-1206]  (hidden comment: Cap)
C72  value 100uF  [LC-1206]  (hidden comment: Cap)
C73  100nF (104) 10% 16V  [0402_C]
C74  value 100uF  [LC-1206]  (hidden comment: Cap)
C75  100nF (104) 10% 16V  [0402_C]
C76  10uF (106) 20% 6.3V  [0402_C]
C77  22uF (226) 20% 6.3V  [0603_C]
C78  value 100uF  [LC-1206]  (hidden comment: Cap)
C79  100nF (104) 10% 16V  [0402_C]
C80  100nF (104) 10% 16V  [0402_C]
C81  10uF (106) 20% 6.3V  [0402_C]
D1  SS54  [SMA(DO-214AC)_S1]
D2  SS54  [SMA(DO-214AC)_S1]
D3  SS54  [SMA(DO-214AC)_S1]
F1  Fuse 1  [1206]
HAT1  respberry-HAT  [RESPBERRY-HAT]
L5  LED  [1608[0603]]
L6  LED  [1608[0603]]
LED1  RGB_LED1206  [RGB]  (value not drawn)
LS1  Bell  [MLT-5020 BZ]
LS2  Bell  [BZ]
PCAM1  Header 15  [MHDR1X15]
PMOD1  Header 6X2A  [SMT-HEADER 6*2]
PMOD2  Header 6X2A  [SMT-HEADER 6*2]
PMOD3  Header 6X2A  [SMT-HEADER 6*2]
PMOD4  Header 6X2A  [SMT-HEADER 6*2]
PMOD5  Header 6X2A  [SMT-HEADER 6*2]
PMOD6  Header 6X2A  [SMT-HEADER 6*2]
PMOD7  Header 6X2A  [SMT-HEADER 6*2]
PMOD8  Header 6X2A  [SMT-HEADER 6*2]
PMOD9  Header 6X2A  [SMT-HEADER 6*2]
Q1  SS8050 Y1  [SOT-23(SOT-23-3)]
Q2  SS8050 Y1  [SOT-23(SOT-23-3)]
R27  0Ω (0R0) ±1%  [0402_R]
R28  0Ω (0R0) ±1%  [0402_R]
R29  51Ω (51R0) ±1%  [0402_R]
R30  1KΩ (1001) ±1%  [0402_R]
R31  1.5KΩ (1501) ±1%  [0402_R]
R32  10Ω (10R0) ±1%  [0402_R]
R33  2KΩ (2001) ±1%  [0402_R]
R34  2KΩ (2001) ±1%  [0402_R]
R35  1KΩ (1001) ±1%  [0402_R]
R36  1.5KΩ (1501) ±1%  [0402_R]
R37  10Ω (10R0) ±1%  [0402_R]
R38  10Ω (10R0) ±1%  [0402_R]
Rp1  470Ω (471) ±5%  [0603_Rx4]
Rp2  470Ω (471) ±5%  [0603_Rx4]
Rp3  470Ω (471) ±5%  [0603_Rx4]
Rp4  470Ω (471) ±5%  [0603_Rx4]
Rp5  470Ω (471) ±5%  [0603_Rx4]
Rp6  470Ω (471) ±5%  [0603_Rx4]
S2  SW-PB  [key 3*4*2]
S3  SW-PB  [key 3*4*2]
S4  SW DIP-2  [sw*2]
S5  SW DIP-2  [sw*2]
SD*1  TF_card  [TF卡座(短体)]  (value not drawn)
U3  SPK0641  [SPK0641HT]
U4  SPK0641  [SPK0641HT]
USB1  USB_5line  [USB-MICRO-5P-2F]

### Ports
ANALOG[13..0] (harness Flexbus), BANK14_IO[42..1], BANK15_IO[9..1], CSI_CAM (harness CSI_CAM), MICLK0, MICLK1, MIDAT0, MIDAT1, PL_BZ, PL_KEY, PL_LED1, PL_LED2, PL_LED3, PL_SW1, PL_SW2, PMOD1 (harness PMOD), PMOD2 (harness PMOD), PMOD3 (harness PMOD), PMOD4 (harness PMOD), PMOD5 (harness PMOD), PMOD6 (harness PMOD), PMOD7 (harness PMOD), PMOD8 (harness PMOD), PMOD9 (harness PMOD), PS_BZ, PS_KEY, PS_LED1, PS_LED2, PS_SW1, PS_SW2, PTE[5..0], USB0D_N, USB0D_P

### Harnesses
PMOD: 1, 2, 3, 4, 5, 6, 7, 8
CSI_CAM: 1, 2, 3, 4, 5, 6, 7, 8, 9, 10

### Nets
3V3: C60.2 C61.2 C64.2 C65.2 C66.2 C67.2 C68.2 C69.2 C70.2 C71.2 C72.2 C73.2 C74.2 C75.2 C76.2 C77.1 C78.2 C79.1 C80.2 C81.2 D1.1(A) HAT1.1(3.3V) HAT1.17(3.3V) PCAM1.15 PMOD1.1 PMOD1.7 PMOD2.1 PMOD2.7 PMOD3.1 PMOD3.7 PMOD4.1 PMOD4.7 PMOD5.1 PMOD5.7 PMOD6.1 PMOD6.7 PMOD7.1 PMOD7.7 PMOD8.1 PMOD8.7 PMOD9.1 PMOD9.7 R29.2 R30.1 R32.2 SD*1.4(VDD) U3.3(SELECT) U3.4(VDD) U4.4(VDD)
5V0: F1.1
GND: C60.1 C61.1 C62.1 C63.1 C64.1 C65.1 C66.1 C67.1 C68.1 C69.1 C70.1 C71.1 C72.1 C73.1 C74.1 C75.1 C76.1 C77.2 C78.1 C79.2 C80.1 C81.1 HAT1.6(GND) HAT1.9(GND) HAT1.14(GND) HAT1.20(GND) HAT1.25(GND) HAT1.30(GND) HAT1.34(GND) HAT1.39(GND) PCAM1.1 PCAM1.4 PCAM1.7 PCAM1.10 PMOD1.2 PMOD1.8 PMOD2.2 PMOD2.8 PMOD3.2 PMOD3.8 PMOD4.2 PMOD4.8 PMOD5.2 PMOD5.8 PMOD6.2 PMOD6.8 PMOD7.2 PMOD7.8 PMOD8.2 PMOD8.8 PMOD9.2 PMOD9.8 Q1.2(E) Q2.2(E) R33.2 R34.2 R35.2 R37.2 R38.2 S3.2 SD*1.6(VSS) U3.5(GND) U3.6(GND) U3.7(GND) U3.8(GND) U4.3(SELECT) U4.5(GND) U4.6(GND) U4.7(GND) U4.8(GND) USB1.5(GND)
VBUS: C62.2 C63.2 D1.2(K) F1.2 HAT1.2(5V) HAT1.4(5V) USB1.1(VBUS)
ANALOG1: PMOD1.6 ; port PMOD5.4
ANALOG2: PMOD1.5 ; port PMOD5.3
ANALOG3: PMOD1.10 ; port PMOD5.6
ANALOG4: PMOD1.9 ; port PMOD5.5
ANALOG5: PMOD1.4 ; port PMOD5.2
ANALOG6: PMOD1.3 ; port PMOD5.1
ANALOG7: PMOD9.12 ; port PMOD4.8
ANALOG8: PMOD9.6 ; port PMOD4.4
ANALOG9: PMOD1.11 ; port PMOD5.7
ANALOG10: PMOD1.12 ; port PMOD5.8
ANALOG11: PMOD9.11 ; port PMOD4.7
ANALOG12: PMOD9.10 ; port PMOD4.6
ANALOG13: PMOD9.9 ; port PMOD4.5
BANK14_IO1: S2.1 ; port PL_KEY
BANK14_IO2: LED1.3(R) ; port PL_LED3
BANK14_IO3: HAT1.5(SCL.1)
BANK14_IO4: LED1.1(B) ; port PL_LED1
BANK14_IO5: LED1.4(G) ; port PL_LED2
BANK14_IO6: R31.1 ; port PL_BZ
BANK14_IO7: HAT1.3(SDA.1)
BANK14_IO8: HAT1.7(GPIO.7)
BANK14_IO9: HAT1.12(GPIO.1)
BANK14_IO10: HAT1.11(GPIO.0)
BANK14_IO11: HAT1.15(GPIO.3)
BANK14_IO12: HAT1.13(GPIO.2)
BANK14_IO13: HAT1.18(GPIO.5)
BANK14_IO14: HAT1.16(GPIO.4)
BANK14_IO15: HAT1.10(RXD)
BANK14_IO16: HAT1.21(MISO)
BANK14_IO17: HAT1.8(TXD)
BANK14_IO18: HAT1.19(MOSI)
BANK14_IO19: HAT1.27(SDA.0)
BANK14_IO20: HAT1.31(GPIO.22)
BANK14_IO21: HAT1.28(SCL.0)
BANK14_IO22: HAT1.24(CE0)
BANK14_IO23: HAT1.26(CE1)
BANK14_IO24: HAT1.23(SCLK)
BANK14_IO25: HAT1.22(GPIO.6)
BANK14_IO26: HAT1.33(GPIO.23)
BANK14_IO27: HAT1.29(GPIO.21)
BANK14_IO28: HAT1.37(GPIO.25)
BANK14_IO29: HAT1.36(GPIO.27)
BANK14_IO30: Rp1.5 ; port PMOD1.4
BANK14_IO32: Rp2.8 ; port PMOD1.5
BANK14_IO33: HAT1.40(GPIO.29)
BANK14_IO34: Rp2.7 ; port PMOD1.6
BANK14_IO35: HAT1.38(GPIO.28)
BANK14_IO36: HAT1.35(GPIO.24)
BANK14_IO37: HAT1.32(GPIO.26)
BANK14_IO38: Rp1.7 ; port PMOD1.2
BANK14_IO39: Rp1.6 ; port PMOD1.3
BANK14_IO40: Rp2.5 ; port PMOD1.8
BANK14_IO41: Rp2.6 ; port PMOD1.7
BANK14_IO42: Rp1.8 ; port PMOD1.1
BANK34_IO1: U3.2(CLK) ; port MICLK0
BANK34_IO2: U3.1(DATA) ; port MIDAT0
BANK34_IO3: Rp4.5 ; port PMOD2.8
BANK34_IO4: Rp5.6 ; port PMOD3.3
BANK34_IO5: Rp5.5 ; port PMOD3.4
BANK34_IO6: Rp6.5 ; port PMOD3.8
BANK34_IO7: Rp5.8 ; port PMOD3.1
BANK34_IO8: Rp5.7 ; port PMOD3.2
BANK34_IO9: Rp6.6 ; port PMOD3.7
BANK34_IO10: Rp4.6 ; port PMOD2.7
BANK34_IO11: Rp6.7 ; port PMOD3.6
BANK34_IO12: Rp4.7 ; port PMOD2.6
BANK34_IO13: S4.1(A1) ; port PL_SW1
BANK34_IO14: Rp3.5 ; port PMOD2.4
BANK34_IO15: Rp6.8 ; port PMOD3.5
BANK34_IO16: Rp3.7 ; port PMOD2.2
BANK34_IO17: Rp3.6 ; port PMOD2.3
BANK34_IO18: Rp4.8 ; port PMOD2.5
BANK34_IO19: Rp3.8 ; port PMOD2.1
BANK34_IO20: S4.2(A2) ; port PL_SW2
BANK35_IO7: PCAM1.12 ; port CSI_CAM.8
BANK35_IO8: PCAM1.11 ; port CSI_CAM.7
BANK35_IO9: PMOD7.4 U4.1(DATA) ; port MIDAT1
BANK35_IO10: PMOD7.3 U4.2(CLK) ; port MICLK1
CAN0_RX: PMOD5.9 ; port PMOD8.5
CAN0_TX: PMOD5.11 ; port PMOD8.7
FTM1_QDA: PMOD4.9 ; port PMOD7.5
FTM1_QDB: PMOD4.10 ; port PMOD7.6
FTM2_QDA: PMOD4.6 ; port PMOD7.4
FTM2_QDB: PMOD4.5 ; port PMOD7.3
LPTMR0: PMOD4.4 ; port PMOD7.2
MIPICLK_N: PCAM1.8 ; port CSI_CAM.5
MIPICLK_P: PCAM1.9 ; port CSI_CAM.6
MIPILANE0_N: PCAM1.2 ; port CSI_CAM.1
MIPILANE0_P: PCAM1.3 ; port CSI_CAM.2
MIPILANE1_N: PCAM1.5 ; port CSI_CAM.3
MIPILANE1_P: PCAM1.6 ; port CSI_CAM.4
PTA5: PMOD4.12 ; port PMOD7.8
PTA6: S5.2(A2) ; port PS_SW1
PTA7: S5.1(A1) ; port PS_SW2
PTA14: PMOD4.11 ; port PMOD7.7
PTA15: PMOD4.3 ; port PMOD7.1
PTA16: PMOD5.12 ; port PMOD8.8
PTA17: PMOD5.5 ; port PMOD8.3
PTA24: PMOD5.6 ; port PMOD8.4
PTA25: PMOD5.4 ; port PMOD8.2
PTA26: PMOD5.3 ; port PMOD8.1
PTA27: PMOD5.10 ; port PMOD8.6
PTA28: PMOD7.6 ; port PMOD9.4
PTA29: PMOD7.5 ; port PMOD9.3
PTB0: PMOD7.12 ; port PMOD9.8
PTB1: PMOD7.11 ; port PMOD9.7
PTB2: PCAM1.13 ; port CSI_CAM.9
PTB3: PCAM1.14 ; port CSI_CAM.10
PTB4: PMOD7.10 ; port PMOD9.6
PTB5: PMOD7.9 ; port PMOD9.5
PTD8: L5.1(A) ; port PS_LED1
PTD9: L6.1(A) ; port PS_LED2
PTE0: SD*1.8(DAT1)
PTE1: SD*1.7(DAT0)
PTE2: SD*1.5(CLK)
PTE3: SD*1.3(CMD)
PTE4: SD*1.2(DTA3)
PTE5: SD*1.1(DTA2)
PTE6: PMOD2.6 ; port PMOD6.4
PTE7: PMOD2.12 ; port PMOD6.8
PTE8: PMOD2.11 ; port PMOD6.7
PTE9: PMOD2.5 ; port PMOD6.3
PTE10: PMOD2.4 ; port PMOD6.2
PTE11: PMOD2.10 ; port PMOD6.6
PTE12: PMOD2.9 ; port PMOD6.5
PTE24: PMOD9.5 ; port PMOD4.3
PTE25: PMOD9.4 ; port PMOD4.2
PTE26: R36.1 ; port PS_BZ
PTE27: S3.1 ; port PS_KEY
PTE28: PMOD2.3 ; port PMOD6.1
RTC_WAKE: PMOD9.3 ; port PMOD4.1
USB0_N: R27.1 USB1.2(DM)
USB0_P: R28.1 USB1.3(DP)
USB0D_N: R27.2 ; port USB0D_N
USB0D_P: R28.2 ; port USB0D_P
NetD2_1: D2.1(A) LS1.2(B) Q1.3(C)
NetD2_2: D2.2(K) LS1.1(A) R29.1
NetD3_1: D3.1(A) LS2.2(B) Q2.3(C)
NetD3_2: D3.2(K) LS2.1(A) R32.1
NetL5_2: L5.2(K) R33.1
NetL6_2: L6.2(K) R34.1
NetLED1_2: LED1.2(+) R30.2
NetPMOD3_3: PMOD3.3 Rp2.1
NetPMOD3_4: PMOD3.4 Rp2.2
NetPMOD3_5: PMOD3.5 Rp2.3
NetPMOD3_6: PMOD3.6 Rp2.4
NetPMOD3_9: PMOD3.9 Rp1.1
NetPMOD3_10: PMOD3.10 Rp1.2
NetPMOD3_11: PMOD3.11 Rp1.3
NetPMOD3_12: PMOD3.12 Rp1.4
NetPMOD6_3: PMOD6.3 Rp4.1
NetPMOD6_4: PMOD6.4 Rp4.2
NetPMOD6_5: PMOD6.5 Rp4.3
NetPMOD6_6: PMOD6.6 Rp4.4
NetPMOD6_9: PMOD6.9 Rp3.1
NetPMOD6_10: PMOD6.10 Rp3.2
NetPMOD6_11: PMOD6.11 Rp3.3
NetPMOD6_12: PMOD6.12 Rp3.4
NetPMOD8_3: PMOD8.3 Rp6.1
NetPMOD8_4: PMOD8.4 Rp6.2
NetPMOD8_5: PMOD8.5 Rp6.3
NetPMOD8_6: PMOD8.6 Rp6.4
NetPMOD8_9: PMOD8.9 Rp5.1
NetPMOD8_10: PMOD8.10 Rp5.2
NetPMOD8_11: PMOD8.11 Rp5.3
NetPMOD8_12: PMOD8.12 Rp5.4
NetQ1_1: Q1.1(B) R31.2
NetQ2_1: Q2.1(B) R36.2
NetR35_1: R35.1 S2.2
NetR37_1: R37.1 S4.3(B2) S4.4(B1)
NetR38_1: R38.1 S5.3(B2) S5.4(B1)

Not connected (* = marked no-connect by the designer): SD*1 9(CD_SW)* 10* 11* 12* 13*; USB1 0(Shield) 4(ID)

### Buses and harness runs
bus ANALOG[13..0]
bus BANK14_IO[42..1] = port BANK14_IO[42..1]
bus BANK15_IO[9..1] = port BANK15_IO[9..1]
bus PTE[5..0] = port PTE[5..0]

### Layout directives
differential pair: MIPICLK_N, MIPICLK_P, MIPILANE0_N, MIPILANE0_P, MIPILANE1_N, MIPILANE1_P, USB0_N, USB0_P, USB0D_N, USB0D_P

### Notes on the sheet
- (in symbol TF_card) SD_card

### Library data of the parts
C60 C65 C73 C75 C79 C80 = 0402 100nF (104) 10% 16V: 贴片电容; ComponentLink1Description: 供应商链接; ComponentLink1URL: http://www.szlcsc.com/product/details_1877.html; Package: 0402; Supplier: LC; SuppliersPartNumber: C1525
C61 C66 C76 C81 = 0402 10uF (106) 20% 6.3V: 贴片电容; ComponentLink1Description: 供应商链接; ComponentLink1URL: http://www.szlcsc.com/product/details_16204.html; Package: 0402; Supplier: LC; SuppliersPartNumber: C15525
C62 = 0402 10nF (103) 10% 50V: 贴片电容; ComponentLink1Description: 供应商链接; ComponentLink1URL: http://www.szlcsc.com/product/details_15869.html; Package: 0402; Supplier: LC; SuppliersPartNumber: C15195
C63 = 0603 10uF (106) 10% 10V: 贴片电容; ComponentLink1Description: 供应商链接; ComponentLink1URL: http://www.szlcsc.com/product/details_20411.html; Package: 0603; Supplier: LC; SuppliersPartNumber: C19702
C64 C67-C72 C74 C78 = Cap: 贴片电容; Published: 8-Jun-2000; LatestRevisionDate: 17-Jul-2002; LatestRevisionNote: Re-released for DXP Platform.; PackageReference: RAD-0.3; Publisher: Altium Limited
C77 = 0603 22uF (226) 20% 6.3V: 贴片电容; ComponentLink1Description: 供应商链接; ComponentLink1URL: http://www.szlcsc.com/product/details_60514.html; Package: 0603; Supplier: LC; SuppliersPartNumber: C59461
D1-D3 = SMA(DO-214AC) SS54: 二极管; ComponentLink1Description: 供应商链接; ComponentLink1URL: http://www.szlcsc.com/product/details_23178.html; Package: SMA(DO-214AC); Supplier: LC; SuppliersPartNumber: C22452
F1 = Fuse 1: Fuse; Published: 8-Jun-2000; LatestRevisionDate: 17-Jul-2002; LatestRevisionNote: Re-released for DXP Platform.; PackageReference: PIN-W2/E2.8; Publisher: Altium Limited; PackageDescription: Thru-Hole; 2 Leads
LS1 LS2 = Bell: Electrical Bell; Published: 24-Mar-1999; LatestRevisionDate: 17-Jul-2002; LatestRevisionNote: Re-released for DXP Platform.; PackageReference: PIN2; Publisher: Altium Limited
PCAM1 = Header 15: Header, 15-Pin; LatestRevisionDate: 17-Jul-2002; LatestRevisionNote: Re-released for DXP Platform.; Publisher: Altium Limited
PMOD1-PMOD9 = Header 6X2A: Header, 6-Pin, Dual row; LatestRevisionDate: 17-Jul-2002; LatestRevisionNote: Re-released for DXP Platform.; Publisher: Altium Limited
Q1 Q2 = SOT-23 SS8050 Y1: 三极管; ComponentLink1Description: 供应商链接; ComponentLink1URL: http://www.szlcsc.com/product/details_2507.html; Package: SOT-23; Supplier: LC; SuppliersPartNumber: C2150
R27 R28 = 0402 0Ω (0R0) 1%: 贴片电阻; ComponentLink1Description: 供应商链接; ComponentLink1URL: http://www.szlcsc.com/product/details_17853.html; Package: 0402; Supplier: LC; SuppliersPartNumber: C17168
R29 = 0402 51Ω (51R0) 1%: 贴片电阻; ComponentLink1Description: 供应商链接; ComponentLink1URL: http://www.szlcsc.com/product/details_25868.html; Package: 0402; Supplier: LC; SuppliersPartNumber: C25125
R30 R35 = 0402 1KΩ (1001) 1%: 贴片电阻; ComponentLink1Description: 供应商链接; ComponentLink1URL: http://www.szlcsc.com/product/details_12256.html; Package: 0402; Supplier: LC; SuppliersPartNumber: C11702
R31 R36 = 0402 1.5KΩ (1501) 1%: 贴片电阻; ComponentLink1Description: 供应商链接; ComponentLink1URL: http://www.szlcsc.com/product/details_26610.html; Package: 0402; Supplier: LC; SuppliersPartNumber: C25867
R32 R37 R38 = 0402 10Ω (10R0) 1%: 贴片电阻; ComponentLink1Description: 供应商链接; ComponentLink1URL: http://www.szlcsc.com/product/details_25820.html; Package: 0402; Supplier: LC; SuppliersPartNumber: C25077
R33 R34 = 0402 2KΩ (2001) 1%: 贴片电阻; ComponentLink1Description: 供应商链接; ComponentLink1URL: http://www.szlcsc.com/product/details_4516.html; Package: 0402; Supplier: LC; SuppliersPartNumber: C4109
Rp1-Rp6 = 0603*4 470Ω (471) 5%: 贴片排阻; ComponentLink1Description: 供应商链接; ComponentLink1URL: http://www.szlcsc.com/product/details_26253.html; Package: 0603*4; Supplier: LC; SuppliersPartNumber: C25510
S2 S3 = SW-PB: Switch
  S2: Published: 24-Mar-1999; LatestRevisionDate: 17-Jul-2002; LatestRevisionNote: Re-released for DXP Platform.; PackageReference: SPST-2; Publisher: Altium Limited; PackageDescription: Switch; 2 Leads
S4 S5 = SW DIP-2: DIP Switch, 2 Position, SPST; Published: 24-Mar-1999; LatestRevisionDate: 17-Jul-2002; LatestRevisionNote: Re-released for DXP Platform.; PackageReference: DIP-4; Publisher: Altium Limited

## Sheet MEMORY.SchDoc
size A4
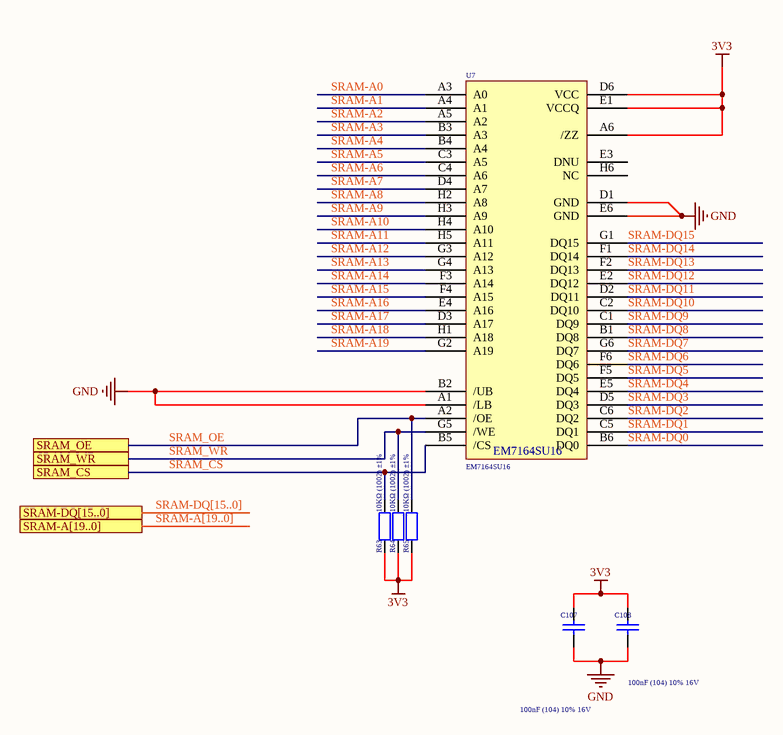
[diagram p4: MEMORY.SchDoc]

### Parts
C107  100nF (104) 10% 16V  [0402_C]
C108  100nF (104) 10% 16V  [0402_C]
R63  10KΩ (1002) ±1%  [0402_R]
R64  10KΩ (1002) ±1%  [0402_R]
R65  10KΩ (1002) ±1%  [0402_R]
U7  EM7164SU16  [BGA48C75P6X8_598X698X104]

### Ports
SRAM-A[19..0], SRAM-DQ[15..0], SRAM_CS, SRAM_OE, SRAM_WR

### Nets
3V3: C107.2 C108.2 R63.1 R64.1 R65.1 U7.A6(/ZZ) U7.D6(VCC) U7.E1(VCCQ)
GND: C107.1 C108.1 U7.A1(/LB) U7.B2(/UB) U7.D1(GND) U7.E6(GND)
SRAM-A0: U7.A3(A0)
SRAM-A1: U7.A4(A1)
SRAM-A2: U7.A5(A2)
SRAM-A3: U7.B3(A3)
SRAM-A4: U7.B4(A4)
SRAM-A5: U7.C3(A5)
SRAM-A6: U7.C4(A6)
SRAM-A7: U7.D4(A7)
SRAM-A8: U7.H2(A8)
SRAM-A9: U7.H3(A9)
SRAM-A10: U7.H4(A10)
SRAM-A11: U7.H5(A11)
SRAM-A12: U7.G3(A12)
SRAM-A13: U7.G4(A13)
SRAM-A14: U7.F3(A14)
SRAM-A15: U7.F4(A15)
SRAM-A16: U7.E4(A16)
SRAM-A17: U7.D3(A17)
SRAM-A18: U7.H1(A18)
SRAM-A19: U7.G2(A19)
SRAM-DQ0: U7.B6(DQ0)
SRAM-DQ1: U7.C5(DQ1)
SRAM-DQ2: U7.C6(DQ2)
SRAM-DQ3: U7.D5(DQ3)
SRAM-DQ4: U7.E5(DQ4)
SRAM-DQ5: U7.F5(DQ5)
SRAM-DQ6: U7.F6(DQ6)
SRAM-DQ7: U7.G6(DQ7)
SRAM-DQ8: U7.B1(DQ8)
SRAM-DQ9: U7.C1(DQ9)
SRAM-DQ10: U7.C2(DQ10)
SRAM-DQ11: U7.D2(DQ11)
SRAM-DQ12: U7.E2(DQ12)
SRAM-DQ13: U7.F2(DQ13)
SRAM-DQ14: U7.F1(DQ14)
SRAM-DQ15: U7.G1(DQ15)
SRAM_CS: R63.2 U7.B5(/CS) ; port SRAM_CS
SRAM_OE: R65.2 U7.A2(/OE) ; port SRAM_OE
SRAM_WR: R64.2 U7.G5(/WE) ; port SRAM_WR

Not connected (* = marked no-connect by the designer): U7 E3(DNU) H6(NC)

### Buses and harness runs
bus SRAM-A[19..0] = port SRAM-A[19..0]
bus SRAM-DQ[15..0] = port SRAM-DQ[15..0]

### Library data of the parts
C107 C108 = 0402 100nF (104) 10% 16V: 贴片电容; ComponentLink1Description: 供应商链接; ComponentLink1URL: http://www.szlcsc.com/product/details_1877.html; Package: 0402; Supplier: LC; SuppliersPartNumber: C1525
R63-R65 = 0402 10KΩ (1002) 1%: 贴片电阻; ComponentLink1Description: 供应商链接; ComponentLink1URL: http://www.szlcsc.com/product/details_26487.html; Package: 0402; Supplier: LC; SuppliersPartNumber: C25744

## Sheet FPGA_CONFIG.SchDoc
size A4
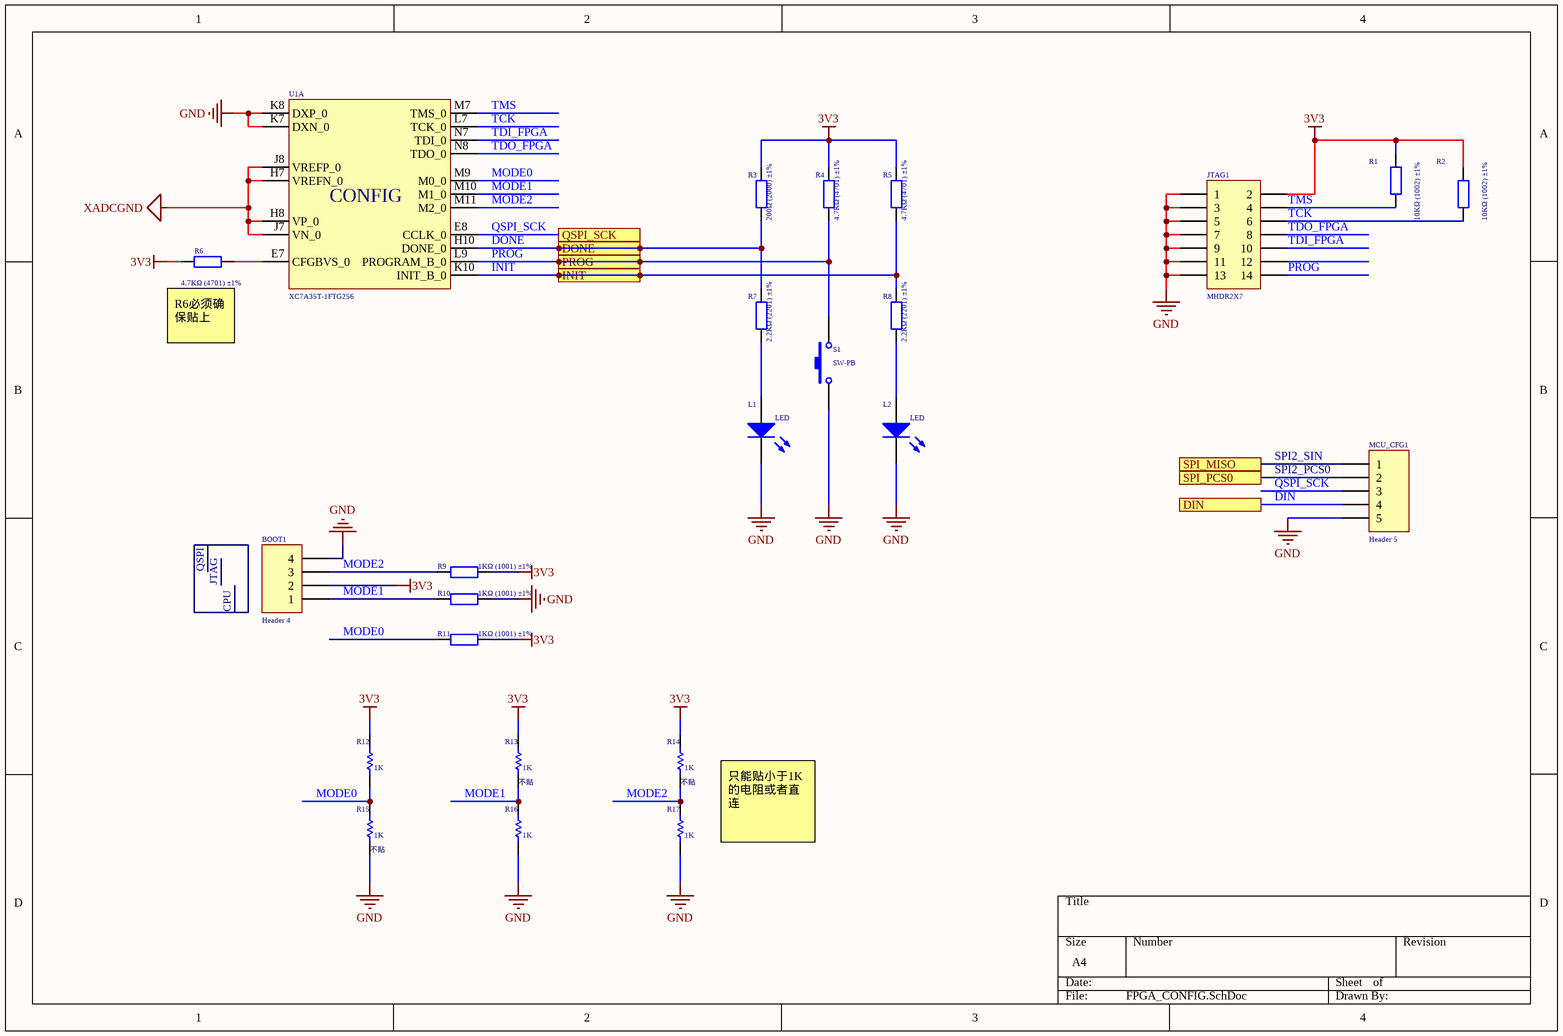
[diagram p5: FPGA_CONFIG.SchDoc]

### Parts
BOOT1  Header 4  [HDR1X4]
JTAG1  MHDR2X7  [SMT7*2-2MM]
L1  LED  [1608[0603]]
L2  LED  [1608[0603]]
MCU_CFG1  Header 5  [MHDR1X5]
R1  10KΩ (1002) ±1%  [0402_R]
R2  10KΩ (1002) ±1%  [0402_R]
R3  200Ω (2000) ±1%  [0402_R]
R4  4.7KΩ (4701) ±1%  [0402_R]
R5  4.7KΩ (4701) ±1%  [0402_R]
R6  4.7KΩ (4701) ±1%  [0402_R]
R7  2.2KΩ (2201) ±1%  [0402_R]
R8  2.2KΩ (2201) ±1%  [0402_R]
R9  1KΩ (1001) ±1%  [0402_R]
R10  1KΩ (1001) ±1%  [0402_R]
R11  1KΩ (1001) ±1%  [0402_R]
R12  value 1K  [1608[0603]]  (hidden comment: Res)
R13  不贴  value 1K  [1608[0603]]
R14  不贴  value 1K  [1608[0603]]
R15  不贴  value 1K  [1608[0603]]
R16  value 1K  [1608[0603]]  (hidden comment: Res)
R17  value 1K  [1608[0603]]  (hidden comment: Res)
S1  SW-PB  [key 3*4*2]
U1  XC7A35T-1FTG256  [BGA100P9X9-81A]  (part A of 7)

### Ports
DIN, DONE, INIT, PROG, QSPI_SCK, SPI_MISO, SPI_PCS0

### Nets
3V3: BOOT1.2 JTAG1.2 R1.2 R2.2 R3.2 R4.2 R5.2 R6.1 R9.2 R11.2 R12.2 R13.2 R14.2
GND: BOOT1.4 JTAG1.1 JTAG1.3 JTAG1.5 JTAG1.7 JTAG1.9 JTAG1.11 JTAG1.13 L1.2(K) L2.2(K) MCU_CFG1.5 R10.2 R15.1 R16.1 R17.1 S1.1 U1.K7(DXN_0) U1.K8(DXP_0)
XADCGND: U1.H7(VREFN_0) U1.H8(VP_0) U1.J7(VN_0) U1.J8(VREFP_0)
DIN: MCU_CFG1.4 ; port DIN
DONE: R3.1 R7.2 U1.H10(DONE_0) ; port DONE
INIT: R5.1 R8.2 U1.K10(INIT_B_0) ; port INIT  [project net FPGA_INIT]
MODE0: R11.1 R12.1 R15.2 U1.M9(M0_0)
MODE1: BOOT1.1 R10.1 R13.1 R16.2 U1.M10(M1_0)
MODE2: BOOT1.3 R9.1 R14.1 R17.2 U1.M11(M2_0)
PROG: JTAG1.14 R4.1 S1.2 U1.L9(PROGRAM_B_0) ; port PROG
QSPI_SCK: MCU_CFG1.3 U1.E8(CCLK_0) ; port QSPI_SCK
SPI2_PCS0: MCU_CFG1.2 ; port SPI_PCS0
SPI2_SIN: MCU_CFG1.1 ; port SPI_MISO
TCK: JTAG1.6 R2.1 U1.L7(TCK_0)
TDI_FPGA: JTAG1.10 U1.N7(TDI_0)
TDO_FPGA: JTAG1.8 U1.N8(TDO_0)
TMS: JTAG1.4 R1.1 U1.M7(TMS_0)
NetL1_1: L1.1(A) R7.1
NetL2_1: L2.1(A) R8.1
NetR6_2: R6.2 U1.E7(CFGBVS_0)

Not connected (* = marked no-connect by the designer): JTAG1 12

### Notes on the sheet
- (near R6) R6必须确保贴上
- QSPI
- JTAG
- CPU
- 只能贴小于1K的电阻或者直连
- (in symbol XC7A35T-1FTG256, part A) CONFIG

### Library data of the parts
BOOT1 = Header 4: Header, 4-Pin; LatestRevisionDate: 17-Jul-2002; LatestRevisionNote: Re-released for DXP Platform.; Publisher: Altium Limited
JTAG1 = MHDR2X7: Header, 7-Pin, Dual row; LatestRevisionDate: 17-Jul-2002; LatestRevisionNote: Re-released for DXP Platform.; Publisher: Altium Limited
MCU_CFG1 = Header 5: Header, 5-Pin; LatestRevisionDate: 17-Jul-2002; LatestRevisionNote: Re-released for DXP Platform.; Publisher: Altium Limited
R1 R2 = 0402 10KΩ (1002) 1%: 贴片电阻; ComponentLink1Description: 供应商链接; ComponentLink1URL: http://www.szlcsc.com/product/details_26487.html; Package: 0402; Supplier: LC; SuppliersPartNumber: C25744
R3 = 0402 200Ω (2000) 1%: 贴片电阻; ComponentLink1Description: 供应商链接; ComponentLink1URL: http://www.szlcsc.com/product/details_25830.html; Package: 0402; Supplier: LC; SuppliersPartNumber: C25087
R4-R6 = 0402 4.7KΩ (4701) 1%: 贴片电阻; ComponentLink1Description: 供应商链接; ComponentLink1URL: http://www.szlcsc.com/product/details_26643.html; Package: 0402; Supplier: LC; SuppliersPartNumber: C25900
R7 R8 = 0402 2.2KΩ (2201) 1%: 贴片电阻; ComponentLink1Description: 供应商链接; ComponentLink1URL: http://www.szlcsc.com/product/details_26622.html; Package: 0402; Supplier: LC; SuppliersPartNumber: C25879
R9-R11 = 0402 1KΩ (1001) 1%: 贴片电阻; ComponentLink1Description: 供应商链接; ComponentLink1URL: http://www.szlcsc.com/product/details_12256.html; Package: 0402; Supplier: LC; SuppliersPartNumber: C11702
R12-R17 = Res: 贴片电阻; Published: 8-Jun-2000; LatestRevisionDate: 17-Jul-2002; LatestRevisionNote: Re-released for DXP Platform.; PackageReference: AXIAL-0.3; Publisher: Altium Limited
S1 = SW-PB: Switch; Published: 24-Mar-1999; LatestRevisionDate: 17-Jul-2002; LatestRevisionNote: Re-released for DXP Platform.; PackageReference: SPST-2; Publisher: Altium Limited; PackageDescription: Switch; 2 Leads

## Sheet FPGA_POWER.SchDoc
size A4
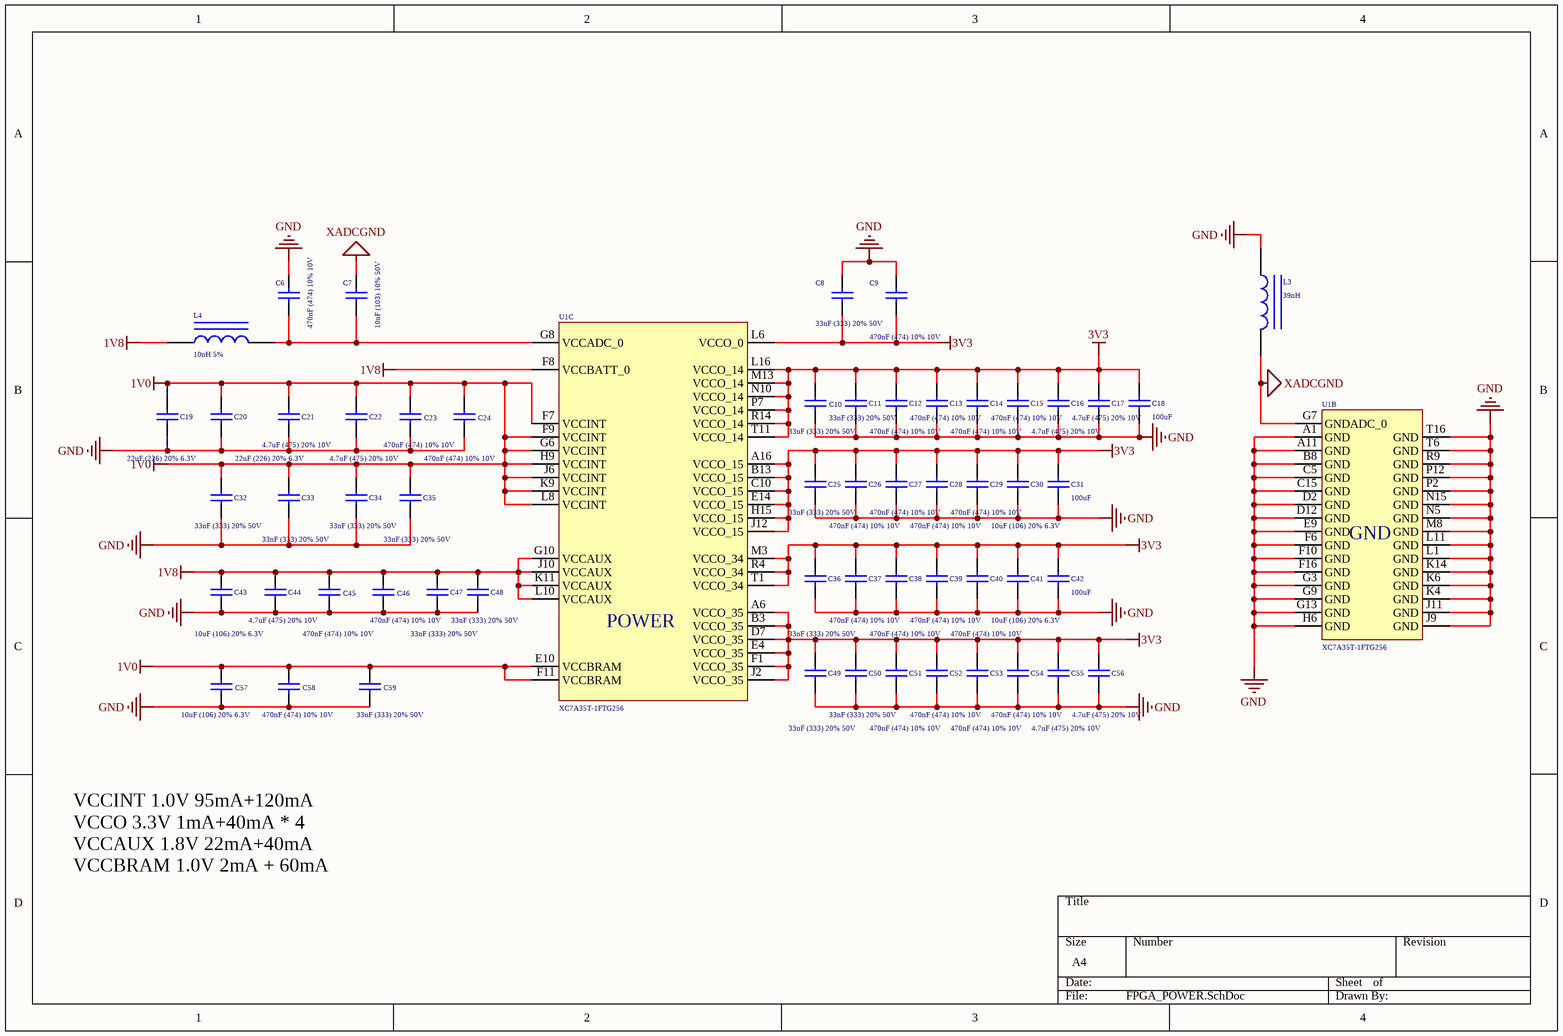
[diagram p6: FPGA_POWER.SchDoc]

### Parts
C6  470nF (474) 10% 10V  [0402_C]
C7  10nF (103) 10% 50V  [0402_C]
C8  33nF (333) 20% 50V  [0402_C]
C9  470nF (474) 10% 10V  [0402_C]
C10  33nF (333) 20% 50V  [0402_C]
C11  33nF (333) 20% 50V  [0402_C]
C12  470nF (474) 10% 10V  [0402_C]
C13  470nF (474) 10% 10V  [0402_C]
C14  470nF (474) 10% 10V  [0402_C]
C15  470nF (474) 10% 10V  [0402_C]
C16  4.7uF (475) 20% 10V  [0402_C]
C17  4.7uF (475) 20% 10V  [0402_C]
C18  value 100uF  [LC-1206]  (hidden comment: Cap)
C19  22uF (226) 20% 6.3V  [0603_C]
C20  22uF (226) 20% 6.3V  [0603_C]
C21  4.7uF (475) 20% 10V  [0402_C]
C22  4.7uF (475) 20% 10V  [0402_C]
C23  470nF (474) 10% 10V  [0402_C]
C24  470nF (474) 10% 10V  [0402_C]
C25  33nF (333) 20% 50V  [0402_C]
C26  470nF (474) 10% 10V  [0402_C]
C27  470nF (474) 10% 10V  [0402_C]
C28  470nF (474) 10% 10V  [0402_C]
C29  470nF (474) 10% 10V  [0402_C]
C30  10uF (106) 20% 6.3V  [0402_C]
C31  value 100uF  [LC-1206]  (hidden comment: Cap)
C32  33nF (333) 20% 50V  [0402_C]
C33  33nF (333) 20% 50V  [0402_C]
C34  33nF (333) 20% 50V  [0402_C]
C35  33nF (333) 20% 50V  [0402_C]
C36  33nF (333) 20% 50V  [0402_C]
C37  470nF (474) 10% 10V  [0402_C]
C38  470nF (474) 10% 10V  [0402_C]
C39  470nF (474) 10% 10V  [0402_C]
C40  470nF (474) 10% 10V  [0402_C]
C41  10uF (106) 20% 6.3V  [0402_C]
C42  value 100uF  [LC-1206]  (hidden comment: Cap)
C43  10uF (106) 20% 6.3V  [0402_C]
C44  4.7uF (475) 20% 10V  [0402_C]
C45  470nF (474) 10% 10V  [0402_C]
C46  470nF (474) 10% 10V  [0402_C]
C47  33nF (333) 20% 50V  [0402_C]
C48  33nF (333) 20% 50V  [0402_C]
C49  33nF (333) 20% 50V  [0402_C]
C50  33nF (333) 20% 50V  [0402_C]
C51  470nF (474) 10% 10V  [0402_C]
C52  470nF (474) 10% 10V  [0402_C]
C53  470nF (474) 10% 10V  [0402_C]
C54  470nF (474) 10% 10V  [0402_C]
C55  4.7uF (475) 20% 10V  [0402_C]
C56  4.7uF (475) 20% 10V  [0402_C]
C57  10uF (106) 20% 6.3V  [0402_C]
C58  470nF (474) 10% 10V  [0402_C]
C59  33nF (333) 20% 50V  [0402_C]
L3  39nH  [0402_L]
L4  10nH 5%  [0402_L]
U1  XC7A35T-1FTG256  [BGA100P9X9-81A]  (parts B,C of 7)

### Nets
1V0: C19.2 C20.2 C21.2 C22.2 C23.2 C24.2 C32.2 C33.2 C34.2 C35.2 C57.2 C58.2 C59.2 U1.E10(VCCBRAM) U1.F7(VCCINT) U1.F9(VCCINT) U1.F11(VCCBRAM) U1.G6(VCCINT) U1.H9(VCCINT) U1.J6(VCCINT) U1.K9(VCCINT) U1.L8(VCCINT)
1V8: C43.2 C44.2 C45.2 C46.2 C47.2 C48.2 L4.1 U1.F8(VCCBATT_0) U1.G10(VCCAUX) U1.J10(VCCAUX) U1.K11(VCCAUX) U1.L10(VCCAUX)
3V3: C8.1 C9.1 C10.2 C11.2 C12.2 C13.2 C14.2 C15.2 C16.2 C17.2 C18.2 C25.2 C26.2 C27.2 C28.2 C29.2 C30.2 C31.2 C36.2 C37.2 C38.2 C39.2 C40.2 C41.2 C42.2 C49.2 C50.2 C51.2 C52.2 C53.2 C54.2 C55.2 C56.2 U1.A6(VCCO_35) U1.A16(VCCO_15) U1.B3(VCCO_35) U1.B13(VCCO_15) U1.C10(VCCO_15) U1.D7(VCCO_35) U1.E4(VCCO_35) U1.E14(VCCO_15) U1.F1(VCCO_35) U1.H15(VCCO_15) U1.J2(VCCO_35) U1.J12(VCCO_15) U1.L6(VCCO_0) U1.L16(VCCO_14) U1.M3(VCCO_34) U1.M13(VCCO_14) U1.N10(VCCO_14) U1.P7(VCCO_14) U1.R4(VCCO_34) U1.R14(VCCO_14) U1.T1(VCCO_34) U1.T11(VCCO_14)
GND: C6.2 C8.2 C9.2 C10.1 C11.1 C12.1 C13.1 C14.1 C15.1 C16.1 C17.1 C18.1 C19.1 C20.1 C21.1 C22.1 C23.1 C24.1 C25.1 C26.1 C27.1 C28.1 C29.1 C30.1 C31.1 C32.1 C33.1 C34.1 C35.1 C36.1 C37.1 C38.1 C39.1 C40.1 C41.1 C42.1 C43.1 C44.1 C45.1 C46.1 C47.1 C48.1 C49.1 C50.1 C51.1 C52.1 C53.1 C54.1 C55.1 C56.1 C57.1 C58.1 C59.1 L3.1 U1.A1(GND) U1.A11(GND) U1.B8(GND) U1.C5(GND) U1.C15(GND) U1.D2(GND) U1.D12(GND) U1.E9(GND) U1.F6(GND) U1.F10(GND) U1.F16(GND) U1.G3(GND) U1.G9(GND) U1.G13(GND) U1.H6(GND) U1.J9(GND) U1.J11(GND) U1.K4(GND) U1.K6(GND) U1.K14(GND) U1.L1(GND) U1.L11(GND) U1.M8(GND) U1.N5(GND) U1.N15(GND) U1.P2(GND) U1.P12(GND) U1.R9(GND) U1.T6(GND) U1.T16(GND)
XADCGND: C7.2 L3.2 U1.G7(GNDADC_0)
NetC6_1: C6.1 C7.1 L4.2 U1.G8(VCCADC_0)

### Notes on the sheet
- VCCINT 1.0V 95mA+120mA
  VCCO 3.3V 1mA+40mA * 4
  VCCAUX 1.8V 22mA+40mA
  VCCBRAM 1.0V 2mA + 60mA
- (in symbol XC7A35T-1FTG256, part C) POWER

### Library data of the parts
C6 C9 C12-C15 C23 C24 C26-C29 C37-C40 C45 C46 C51-C54 C58 = 0402 470nF (474) 10% 10V: 贴片电容; ComponentLink1Description: 供应商链接; ComponentLink1URL: http://www.szlcsc.com/product/details_48344.html; Package: 0402; Supplier: LC; SuppliersPartNumber: C47339
C7 = 0402 10nF (103) 10% 50V: 贴片电容; ComponentLink1Description: 供应商链接; ComponentLink1URL: http://www.szlcsc.com/product/details_15869.html; Package: 0402; Supplier: LC; SuppliersPartNumber: C15195
C8 C10 C11 C25 C32-C36 C47-C50 C59 = 0402 33nF (333) 20% 50V: 贴片电容; ComponentLink1Description: 供应商链接; ComponentLink1URL: http://www.szlcsc.com/product/details_1937.html; Package: 0402; Supplier: LC; SuppliersPartNumber: C1585
C16 C17 C21 C22 C44 C55 C56 = 0402 4.7uF (475) 20% 10V: 贴片电容; ComponentLink1Description: 供应商链接; ComponentLink1URL: http://www.szlcsc.com/product/details_24469.html; Package: 0402; Supplier: LC; SuppliersPartNumber: C23733
C18 C31 C42 = Cap: 贴片电容; Published: 8-Jun-2000; LatestRevisionDate: 17-Jul-2002; LatestRevisionNote: Re-released for DXP Platform.; PackageReference: RAD-0.3; Publisher: Altium Limited
C19 C20 = 0603 22uF (226) 20% 6.3V: 贴片电容; ComponentLink1Description: 供应商链接; ComponentLink1URL: http://www.szlcsc.com/product/details_60514.html; Package: 0603; Supplier: LC; SuppliersPartNumber: C59461
C30 C41 C43 C57 = 0402 10uF (106) 20% 6.3V: 贴片电容; ComponentLink1Description: 供应商链接; ComponentLink1URL: http://www.szlcsc.com/product/details_16204.html; Package: 0402; Supplier: LC; SuppliersPartNumber: C15525
L3 = 0402 39nH: 贴片电感; ComponentLink1Description: 供应商链接; ComponentLink1URL: http://www.szlcsc.com/product/details_27187.html; Package: 0402; Supplier: LC; SuppliersPartNumber: C26443
L4 = 0402 10nH 5%: 贴片电感; ComponentLink1Description: 供应商链接; ComponentLink1URL: http://www.szlcsc.com/product/details_27896.html; Package: 0402; Supplier: LC; SuppliersPartNumber: C27147